# EAGLE design OBC (EAGLE 7.7.0)
OBC with integrated microcontroller
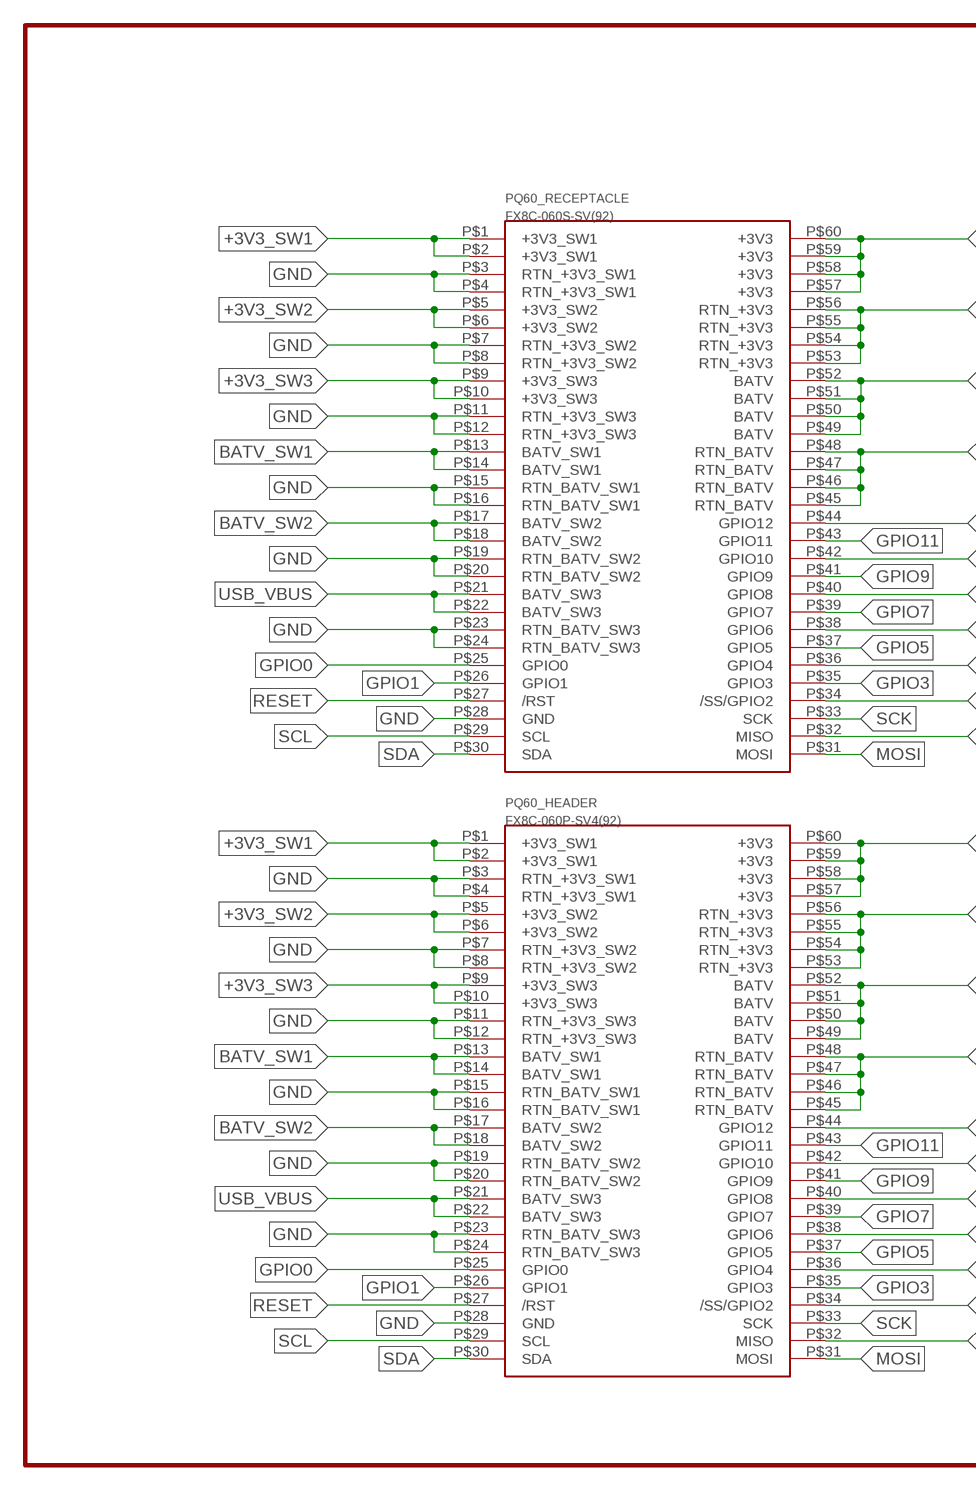
[diagram p0: schematic, sheet 1, part 1 of 2]
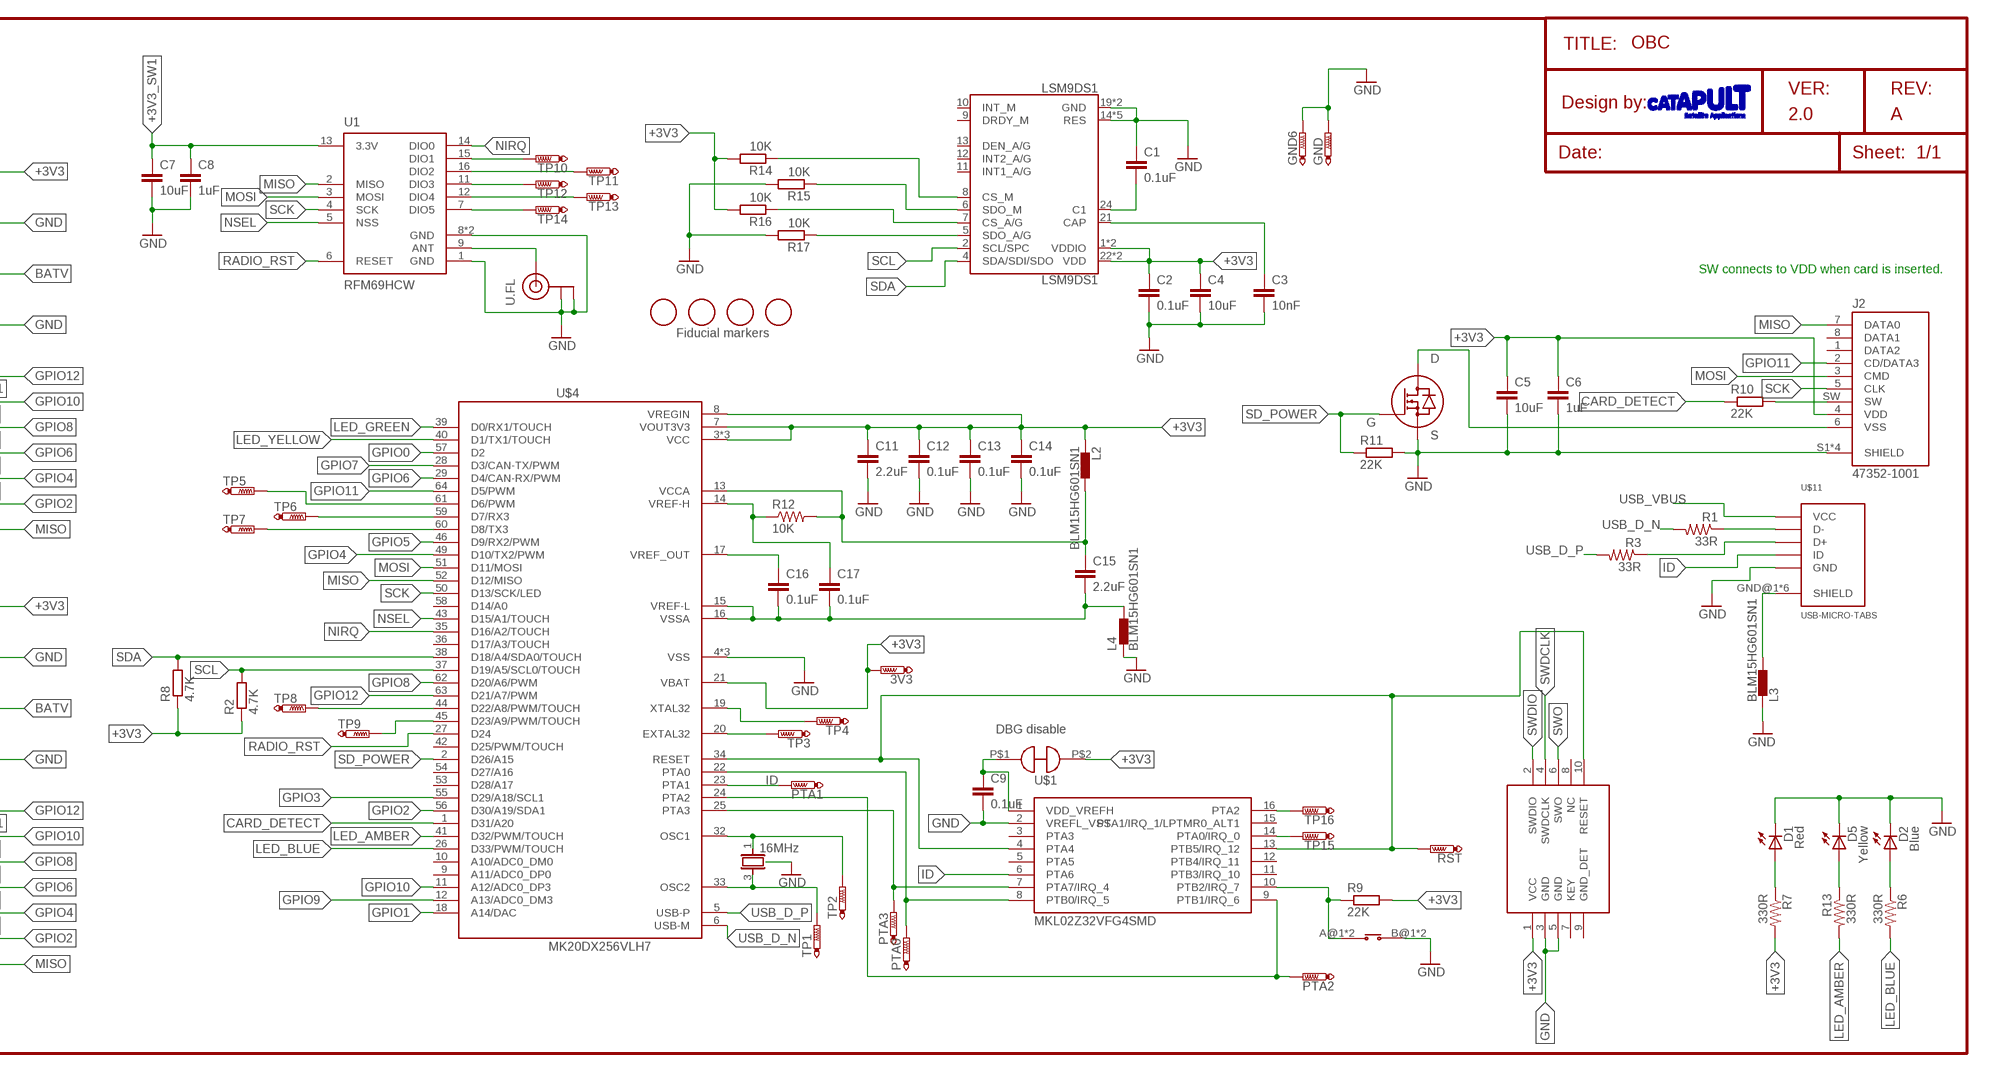
[diagram p1: schematic, sheet 1, part 2 of 2]

## Parts
3V3  PTR1TP06R  [TP06R]
C1  0.1uF  C-EUC0402  [C0402]
C2  0.1uF  C-EUC0402  [C0402]
C3  10nF  C-EUC0402  [C0402]
C4  10uF  C-EUC0805  [C0805]
C5  10uF  C-EUC0805  [C0805]
C6  1uF  C-EUC0603  [C0603]
C7  10uF  C-EUC0805  [C0805]
C8  1uF  C-EUC0603  [C0603]
C9  0.1uF  C-EUC0402  [C0402]
C11  2.2uF  C-EUC0603  [C0603]
C12  0.1uF  C-EUC0402  [C0402]
C13  0.1uF  C-EUC0402  [C0402]
C14  0.1uF  C-EUC0402  [C0402]
C15  2.2uF  C-EUC0603  [C0603]
C16  0.1uF  C-EUC0402  [C0402]
C17  0.1uF  C-EUC0402  [C0402]
D1  Red  LEDCHIPLED_0603  [CHIPLED_0603]
D2  Blue  LEDCHIPLED_0603  [CHIPLED_0603]
D5  Yellow  LEDCHIPLED_0603  [CHIPLED_0603]
ERASE  EVPAF7B70  [EVPAF7B70]
FD1  FIDUCIAL  [FIDUCIAL_1MM]
FD2  FIDUCIAL  [FIDUCIAL_1MM]
FD3  FIDUCIAL  [FIDUCIAL_1MM]
FD4  FIDUCIAL  [FIDUCIAL_1MM]
GND  PTR1TP06R  [TP06R]
GND6  PTR1TP06R  [TP06R]
J2  47352-1001  [MOLEX_47352-1001]
L2  BLM15HG601SN1  [0402]
L3  BLM15HG601SN1  [0402]
L4  BLM15HG601SN1  [0402]
LSM9DS1  LSM9DS1  [LGA24-8X4]
NDK_NX3225SA  16MHz  NDKCRYSTAL  [4SMD_DFN_LCC]
PQ60_HEADER  FX8C-060P-SV4(92)  [FX8C-060P-SV4(92)]
PQ60_RECEPTACLE  FX8C-060S-SV(92)  [FX8C-060S-SV(92)]
PTA0  PTR1TP06R  [TP06R]
PTA1  PTR1TP06R  [TP06R]
PTA2  PTR1TP06R  [TP06R]
PTA3  PTR1TP06R  [TP06R]
R1  33R  RESISTOR0603-RES  [0603-RES]
R2  4.7K  R-EU_R0402  [R0402]
R3  33R  RESISTOR0603-RES  [0603-RES]
R6  330R  RESISTOR0603-RES  [0603-RES]
R7  330R  RESISTOR0603-RES  [0603-RES]
R8  4.7K  R-EU_R0402  [R0402]
R9  22K  R-EU_R0402  [R0402]
R10  22K  R-EU_R0402  [R0402]
R11  22K  R-EU_R0402  [R0402]
R12  10K  RESISTOR0402-RES  [0402-RES]
R13  330R  RESISTOR0603-RES  [0603-RES]
R14  10K  R-EU_R0402  [R0402]
R15  10K  R-EU_R0402  [R0402]
R16  10K  R-EU_R0402  [R0402]
R17  10K  R-EU_R0402  [R0402]
RST  PTR1TP06R  [TP06R]
SJ3  SJNC  [SJNC]
TP1  PTR1TP06R  [TP06R]
TP2  PTR1TP06R  [TP06R]
TP3  PTR1TP06R  [TP06R]
TP4  PTR1TP06R  [TP06R]
TP5  PTR1TP06R  [TP06R]
TP6  PTR1TP06R  [TP06R]
TP7  PTR1TP06R  [TP06R]
TP8  PTR1TP06R  [TP06R]
TP9  PTR1TP06R  [TP06R]
TP10  PTR1TP06R  [TP06R]
TP11  PTR1TP06R  [TP06R]
TP12  PTR1TP06R  [TP06R]
TP13  PTR1TP06R  [TP06R]
TP14  PTR1TP06R  [TP06R]
TP15  PTR1TP06R  [TP06R]
TP16  PTR1TP06R  [TP06R]
U1  RFM69HCW  [RFM69HCW-XXXS2]
U$1  MKL02Z32VFG4SMD  [QFN16]
U$3  PMV40UN2  [SOT23-3]
U$4  MK20DX256VLH7  [QFP50P1200X1200X160-64N]
U$9  SWD_10_PIN  [SWD_10_PIN]
U$11  USB-MICRO-TABS  [USB-MICRO-TABS]
U.FL  U.FL  [U.FL]

## Nets
+3V3: 3V3.TP C2.1 C4.1 C5.1 C6.1 C11.1 C12.1 C13.1 C14.1 J2.4(VDD) L2.1 LSM9DS1.1(VDDIO) LSM9DS1.3(VDDIO) LSM9DS1.22(VDD) LSM9DS1.23(VDD) PQ60_HEADER.P$57(+3V3) PQ60_HEADER.P$58(+3V3) PQ60_HEADER.P$59(+3V3) PQ60_HEADER.P$60(+3V3) PQ60_RECEPTACLE.P$57(+3V3) PQ60_RECEPTACLE.P$58(+3V3) PQ60_RECEPTACLE.P$59(+3V3) PQ60_RECEPTACLE.P$60(+3V3) R2.1 R7.2 R8.1 R9.2 R14.2 R16.2 SJ3.P$2 U$4.3(VCC) U$4.7(VOUT3V3) U$4.8(VREGIN) U$4.21(VBAT) U$4.30(VCC) U$4.48(VCC) U$9.1(VCC)
+3V3_SW1: C7.1 C8.1 PQ60_HEADER.P$1(+3V3_SW1) PQ60_HEADER.P$2(+3V3_SW1) PQ60_RECEPTACLE.P$1(+3V3_SW1) PQ60_RECEPTACLE.P$2(+3V3_SW1) U1.13(3.3V)
+3V3_SW2: PQ60_HEADER.P$5(+3V3_SW2) PQ60_HEADER.P$6(+3V3_SW2) PQ60_RECEPTACLE.P$5(+3V3_SW2) PQ60_RECEPTACLE.P$6(+3V3_SW2)
+3V3_SW3: PQ60_HEADER.P$9(+3V3_SW3) PQ60_HEADER.P$10(+3V3_SW3) PQ60_RECEPTACLE.P$9(+3V3_SW3) PQ60_RECEPTACLE.P$10(+3V3_SW3)
BATV: PQ60_HEADER.P$49(BATV) PQ60_HEADER.P$50(BATV) PQ60_HEADER.P$51(BATV) PQ60_HEADER.P$52(BATV) PQ60_RECEPTACLE.P$49(BATV) PQ60_RECEPTACLE.P$50(BATV) PQ60_RECEPTACLE.P$51(BATV) PQ60_RECEPTACLE.P$52(BATV)
BATV_SW1: PQ60_HEADER.P$13(BATV_SW1) PQ60_HEADER.P$14(BATV_SW1) PQ60_RECEPTACLE.P$13(BATV_SW1) PQ60_RECEPTACLE.P$14(BATV_SW1)
BATV_SW2: PQ60_HEADER.P$17(BATV_SW2) PQ60_HEADER.P$18(BATV_SW2) PQ60_RECEPTACLE.P$17(BATV_SW2) PQ60_RECEPTACLE.P$18(BATV_SW2)
CARD_DETECT: R10.1 U$4.1(D31/A20)
GND: C1.1 C2.2 C3.2 C4.2 C5.2 C6.2 C7.2 C8.2 C9.2 C11.2 C12.2 C13.2 C14.2 D1.C D2.C D5.C ERASE.B@1 ERASE.B@2 GND6.TP GND.TP J2.S1(SHIELD) J2.S2(SHIELD) J2.S3(SHIELD) J2.S4(SHIELD) L3.1 L4.1 LSM9DS1.14(RES) LSM9DS1.15(RES) LSM9DS1.16(RES) LSM9DS1.17(RES) LSM9DS1.18(RES) LSM9DS1.19(GND) LSM9DS1.20(GND) NDK_NX3225SA.GND NDK_NX3225SA.GND@1(GND) NDK_NX3225SA.GND@2(GND) PQ60_HEADER.P$3(RTN_+3V3_SW1) PQ60_HEADER.P$4(RTN_+3V3_SW1) PQ60_HEADER.P$7(RTN_+3V3_SW2) PQ60_HEADER.P$8(RTN_+3V3_SW2) PQ60_HEADER.P$11(RTN_+3V3_SW3) PQ60_HEADER.P$12(RTN_+3V3_SW3) PQ60_HEADER.P$15(RTN_BATV_SW1) PQ60_HEADER.P$16(RTN_BATV_SW1) PQ60_HEADER.P$19(RTN_BATV_SW2) PQ60_HEADER.P$20(RTN_BATV_SW2) PQ60_HEADER.P$23(RTN_BATV_SW3) PQ60_HEADER.P$24(RTN_BATV_SW3) PQ60_HEADER.P$28(GND) PQ60_HEADER.P$45(RTN_BATV) PQ60_HEADER.P$46(RTN_BATV) PQ60_HEADER.P$47(RTN_BATV) PQ60_HEADER.P$48(RTN_BATV) PQ60_HEADER.P$53(RTN_+3V3) PQ60_HEADER.P$54(RTN_+3V3) PQ60_HEADER.P$55(RTN_+3V3) PQ60_HEADER.P$56(RTN_+3V3) PQ60_RECEPTACLE.P$3(RTN_+3V3_SW1) PQ60_RECEPTACLE.P$4(RTN_+3V3_SW1) PQ60_RECEPTACLE.P$7(RTN_+3V3_SW2) PQ60_RECEPTACLE.P$8(RTN_+3V3_SW2) PQ60_RECEPTACLE.P$11(RTN_+3V3_SW3) PQ60_RECEPTACLE.P$12(RTN_+3V3_SW3) PQ60_RECEPTACLE.P$15(RTN_BATV_SW1) PQ60_RECEPTACLE.P$16(RTN_BATV_SW1) PQ60_RECEPTACLE.P$19(RTN_BATV_SW2) PQ60_RECEPTACLE.P$20(RTN_BATV_SW2) PQ60_RECEPTACLE.P$23(RTN_BATV_SW3) PQ60_RECEPTACLE.P$24(RTN_BATV_SW3) PQ60_RECEPTACLE.P$28(GND) PQ60_RECEPTACLE.P$45(RTN_BATV) PQ60_RECEPTACLE.P$46(RTN_BATV) PQ60_RECEPTACLE.P$47(RTN_BATV) PQ60_RECEPTACLE.P$48(RTN_BATV) PQ60_RECEPTACLE.P$53(RTN_+3V3) PQ60_RECEPTACLE.P$54(RTN_+3V3) PQ60_RECEPTACLE.P$55(RTN_+3V3) PQ60_RECEPTACLE.P$56(RTN_+3V3) R11.2 R15.2 R17.2 U1.1(GND) U1.8(GND) U1.10(GND) U$1.2(VREFL_VSS) U$3.2(S) U$4.4(VSS) U$4.31(VSS) U$4.47(VSS) U$9.3(GND) U$9.5(GND) U$11.PIN$5(GND) U.FL.P$1(GND) U.FL.P$2(GND)
GPIO0: PQ60_HEADER.P$25(GPIO0) PQ60_RECEPTACLE.P$25(GPIO0) U$4.57(D2)
GPIO1: PQ60_HEADER.P$26(GPIO1) PQ60_RECEPTACLE.P$26(GPIO1) U$4.18(A14/DAC)
GPIO2: PQ60_HEADER.P$34(/SS/GPIO2) PQ60_RECEPTACLE.P$34(/SS/GPIO2) U$4.56(D30/A19/SDA1)
GPIO3: PQ60_HEADER.P$35(GPIO3) PQ60_RECEPTACLE.P$35(GPIO3) U$4.55(D29/A18/SCL1)
GPIO4: PQ60_HEADER.P$36(GPIO4) PQ60_RECEPTACLE.P$36(GPIO4) U$4.49(D10/TX2/PWM)
GPIO5: PQ60_HEADER.P$37(GPIO5) PQ60_RECEPTACLE.P$37(GPIO5) U$4.46(D9/RX2/PWM)
GPIO6: PQ60_HEADER.P$38(GPIO6) PQ60_RECEPTACLE.P$38(GPIO6) U$4.29(D4/CAN-RX/PWM)
GPIO7: PQ60_HEADER.P$39(GPIO7) PQ60_RECEPTACLE.P$39(GPIO7) U$4.28(D3/CAN-TX/PWM)
GPIO8: PQ60_HEADER.P$40(GPIO8) PQ60_RECEPTACLE.P$40(GPIO8) U$4.62(D20/A6/PWM)
GPIO9: PQ60_HEADER.P$41(GPIO9) PQ60_RECEPTACLE.P$41(GPIO9) U$4.12(A13/ADC0_DM3)
GPIO10: PQ60_HEADER.P$42(GPIO10) PQ60_RECEPTACLE.P$42(GPIO10) U$4.11(A12/ADC0_DP3)
GPIO11: J2.2(CD/DATA3) PQ60_HEADER.P$43(GPIO11) PQ60_RECEPTACLE.P$43(GPIO11) U$4.64(D5/PWM)
GPIO12: PQ60_HEADER.P$44(GPIO12) PQ60_RECEPTACLE.P$44(GPIO12) U$4.63(D21/A7/PWM)
ID: PTA1.TP U$1.6(PTA6) U$4.23(PTA1) U$11.P$4(ID)
LED_AMBER: R13.2 U$4.41(D32/PWM/TOUCH)
LED_BLUE: R6.2 U$4.26(D33/PWM/TOUCH)
LED_GREEN: U$4.39(D0/RX1/TOUCH)
LED_YELLOW: U$4.40(D1/TX1/TOUCH)
MISO: J2.7(DATA0) PQ60_HEADER.P$32(MISO) PQ60_RECEPTACLE.P$32(MISO) U1.2(MISO) U$4.52(D12/MISO)
MOSI: J2.3(CMD) PQ60_HEADER.P$31(MOSI) PQ60_RECEPTACLE.P$31(MOSI) U1.3(MOSI) U$4.51(D11/MOSI)
N$1: NDK_NX3225SA.1 TP2.TP U$4.32(OSC1)
N$2: C9.1 SJ3.P$1 U$1.1(VDD_VREFH)
N$3: ERASE.A@1 ERASE.A@2 R9.1 U$1.10(PTB2/IRQ_7)
N$4: TP4.TP U$4.19(XTAL32)
N$5: R3.1 U$11.P$3(D+)
N$6: R1.1 U$11.P$2(D-)
N$7: TP3.TP U$4.20(EXTAL32)
N$8: TP5.TP U$4.61(D6/PWM)
N$9: J2.SW R10.2
N$11: TP16.TP U$1.16(PTA2)
N$12: TP10.TP U1.15(DIO1)
N$13: U1.9(ANT) U.FL.P$3(SIGNAL)
N$14: TP11.TP U1.16(DIO2)
N$15: J2.6(VSS) U$3.3(D)
N$16: TP12.TP U1.11(DIO3)
N$17: D2.A R6.1
N$18: TP13.TP U1.12(DIO4)
N$19: TP14.TP U1.7(DIO5)
N$20: RST.TP U$1.4(PTA4) U$1.13(PTB5/IRQ_12) U$4.34(RESET) U$9.10(RESET)
N$21: TP15.TP U$1.14(PTA0/IRQ_0)
N$22: D1.A R7.1
N$23: NDK_NX3225SA.3 TP1.TP U$4.33(OSC2)
N$24: C15.1 L2.2 R12.2 U$4.13(VCCA)
N$25: C17.1 R12.1 U$4.14(VREF-H)
N$26: C15.2 C16.2 C17.2 L4.2 U$4.15(VREF-L) U$4.16(VSSA)
N$27: C16.1 U$4.17(VREF_OUT)
N$28: TP6.TP U$4.59(D7/RX3)
N$29: TP7.TP U$4.60(D8/TX3)
N$30: TP8.TP U$4.44(D22/A8/PWM/TOUCH)
N$31: TP9.TP U$4.45(D23/A9/PWM/TOUCH)
N$32: C1.2 LSM9DS1.24(C1)
N$33: C3.1 LSM9DS1.21(CAP)
N$34: LSM9DS1.7(CS_A/G) R16.1
N$35: LSM9DS1.8(CS_M) R14.1
N$37: D5.A R13.1
N$38: LSM9DS1.6(SDO_M) R15.1
N$39: LSM9DS1.5(SDO_A/G) R17.1
NIRQ: U1.14(DIO0) U$4.35(D16/A2/TOUCH)
NSEL: U1.5(NSS) U$4.43(D15/A1/TOUCH)
RADIO_RST: U1.6(RESET) U$4.27(D24)
RESET: PQ60_HEADER.P$27(/RST) PQ60_RECEPTACLE.P$27(/RST)
SCK: J2.5(CLK) PQ60_HEADER.P$33(SCK) PQ60_RECEPTACLE.P$33(SCK) U1.4(SCK) U$4.50(D13/SCK/LED)
SCL: LSM9DS1.2(SCL/SPC) PQ60_HEADER.P$29(SCL) PQ60_RECEPTACLE.P$29(SCL) R2.2 U$4.37(D19/A5/SCL0/TOUCH)
SD_POWER: R11.1 U$3.1(G) U$4.2(D26/A15)
SDA: LSM9DS1.4(SDA/SDI/SDO) PQ60_HEADER.P$30(SDA) PQ60_RECEPTACLE.P$30(SDA) R8.2 U$4.38(D18/A4/SDA0/TOUCH)
SHIELD: L3.2 U$11.GND@1(SHIELD) U$11.GND@2(SHIELD) U$11.GND@3(SHIELD) U$11.GND@4(SHIELD) U$11.GND@5(SHIELD) U$11.GND@6(SHIELD)
SWDCLK: PTA0.TP U$1.8(PTB0/IRQ_5) U$4.22(PTA0) U$9.4(SWDCLK)
SWDIO: PTA3.TP U$1.7(PTA7/IRQ_4) U$4.25(PTA3) U$9.2(SWDIO)
SWO: PTA2.TP U$1.9(PTB1/IRQ_6) U$4.24(PTA2) U$9.6(SWO)
USB_D_N [USB]: R1.2 U$4.6(USB-M)
USB_D_P [USB]: R3.2 U$4.5(USB-P)
USB_VBUS: PQ60_HEADER.P$21(BATV_SW3) PQ60_HEADER.P$22(BATV_SW3) PQ60_RECEPTACLE.P$21(BATV_SW3) PQ60_RECEPTACLE.P$22(BATV_SW3) U$11.P$1(VCC)
Unconnected: J2.1(DATA2) J2.8(DATA1) LSM9DS1.9(DRDY_M) LSM9DS1.10(INT_M) LSM9DS1.11(INT1_A/G) LSM9DS1.12(INT2_A/G) LSM9DS1.13(DEN_A/G) U$1.3(PTA3) U$1.5(PTA5) U$1.11(PTB3/IRQ_10) U$1.12(PTB4/IRQ_11) U$1.15(PTA1/IRQ_1/LPTMR0_ALT1) U$4.9(A11/ADC0_DP0) U$4.10(A10/ADC0_DM0) U$4.36(D17/A3/TOUCH) U$4.42(D25/PWM/TOUCH) U$4.53(D28/A17) U$4.54(D27/A16) U$4.58(D14/A0) U$9.7(KEY) U$9.8(NC) U$9.9(GND_DET)

## Notes on the sheet
- TITLE:
- VER: | REV:
- Design by:
- 2.0 | A
- Date: | Sheet:
- SW connects to VDD when card is inserted.
- Fiducial markers
- DBG disable

## Library data of the parts
3V3 GND GND6 PTA0 PTA1-PTA3 RST TP1-TP16 = testpad:PTR1: TEST PIN
C1-C9 C11-C17 = resistor:C-EU: CAPACITOR, European symbol
D1 D2 D5 = adafruit:LED: LED OSRAM: - CHIPLED LG R971, LG N971, LY N971, LG Q971, LY Q971, LO R971, LY R971 LH N974, LH R974 LS Q976, LO Q976, LY Q976 LO Q996 - Hyper CHIPLED LW Q18S LB Q993, LB Q99A, LB R99A - SideLED LS A670, LO A670, LY A670, LG A670, LP A670 LB A673, LV A673, LT A673, LW A673 LH A674 LY A675 LS A676, LA A676, LO A676, LY A676, LW A676 LS A679, LY A679, LG A679 - Hyper Micro SIDELED® LS Y876, LA Y876, LO Y876, LY Y876 LT Y87S - SmartLED LW L88C, LW L88S LB L89C, LB L89S, LG L890 LS L89K, LO L89K, LY L89K LS L896, LA L896, LO L896, LY L896 - TOPLED LS T670, LO T670, LY T670, LG T670, LP T670 LSG T670, LSP T670, LSY T670, LOP T670, LYG T670 LG T671, LOG T671, LSG T671 LB T673, LV T673, LT T673, LW T673 LH T674 LS T676, LA T676, LO T676, LY T676, LB T676, LH T676, LSB T676, LW T676 LB T67C, LV T67C, LT T67C, LS T67K, LO T67K, LY T67K, LW E67C LS E67B, LA E67B, LO E67B, LY E67B, LB E67C, LV E67C, LT E67C LW T67C LS T679, LY T679, LG T679 LS T770, LO T770, LY T770, LG T770, LP T770 LB T773, LV T773, LT T773, LW T773 LH T774 LS E675, LA E675, LY E675, LS T675 LS T776, LA T776, LO T776, LY T776, LB T776 LHGB T686 LT T68C, LB T68C - Hyper Mini TOPLED® LB M676 - Mini TOPLED Santana® LG M470 LS M47K, LO M47K, LY M47K Source: http://www.osram.convergy.de/
ERASE = ubo_PQ60:EVPAF7B70
FD1-FD4 = ubo_PQ60:FIDUCIAL: For use by pick and place machines to calibrate the vision/machine, 1mm By microbuilder.eu
J2 = ubo_PQ60:47352-1001: 1.10mm Pitch microSD Card Connector, Push-Push Type, with VSS (Supply Voltage Ground) Detect Switch, Lead-Free; AVAILABILITY: Unavailable; DESCRIPTION: 1.10mm Pitch microSD Card Connector, Push-Push Type, with VSS _Supply Voltage Ground_ Detect Switch, Lead-Free; MF: Molex; MP: 473521001; PACKAGE: None; PRICE: None
L2-L4 = inductors:BLM15H: EMIFIL (R) Chip Ferrite Bead for GHz Noise Source: http://www.murata.com/ Ferrite Bead BLM15H.pdf
LSM9DS1 = ubo_PQ60:LSM9DS1: LSM9DS1 3D accelerometer, gyroscope & magnetometer The LSM9DS1 is a system-in-package featuring a 3D digital linear acceleration sensor, a 3D digital angular rate sensor, and a 3D digital magnetic sensor. The LSM9DS1 has a linear acceleration full scale of ±2g/±4g/±8/±16 g, a magnetic field full scale of ±4/±8/±12/±16 gauss and an angular rate of ±245/±500/±2000 dps. The LSM9DS1 includes an I2 C serial bus interface supporting standard and fast mode (100 kHz and 400 kHz) and an SPI serial standard interface. Magnetic, accelerometer and gyroscope sensing can be enabled or set in power-down mode separately for smart power management. The LSM9DS1 is available in a plastic land grid array package (LGA) and it is guaranteed to operate over an extended temperature range from -40 °C to +85 °C.; PROD_ID: IC-12536
NDK_NX3225SA = OBC:NDKCRYSTAL
PQ60_HEADER = OBC:FX8C-060P-SV4(92)
PQ60_RECEPTACLE = Template:FX8C-060S-SV(92)
R1 R3 R6 R7 R12 R13 = SparkFun-Passives:RESISTOR: Resistor Basic schematic elements and footprints for 0603, 1206, and PTH resistors.
R2 R8-R11 R14-R17 = resistor:R-EU_: RESISTOR, European symbol
SJ3 = ubo_PQ60:SJNC
U1 = SparkFun-RF:RFM69H
U$1 = OBC:MKL02Z32VFG4: Kinetis KL02 32 KB Flash 48 MHz Cortex-M0+ Based Microcontroller
U$3 = ubo_PQ60:PMV40UN2
U$4 = Teensy_3_Series_Chip_v1.2:MK20DX256VLH7: This is a footprint for the MK20dx256VHL7, the chip at the heart of the Teensy 3.1. Notable upgrades over the Teensy 3.0 include more Flash Memory, RAM, a DAC output, additional ADC pins, etc. Remember, if you want to use USB, VOut3v3 has to be attached to the 3.3V bus.
U$9 = OBC:SWD_10_PIN
U$11 = ubo_PQ60:USB-MICRO-TABS
U.FL = SparkFun-Connectors:U.FL: SMD antenna connector- WRL-09144; PROD_ID: CONN-09193

## Net classes
1 USB: width 1.295 mm, drill 0.4 mm, clearance 0.15 mm

## Board
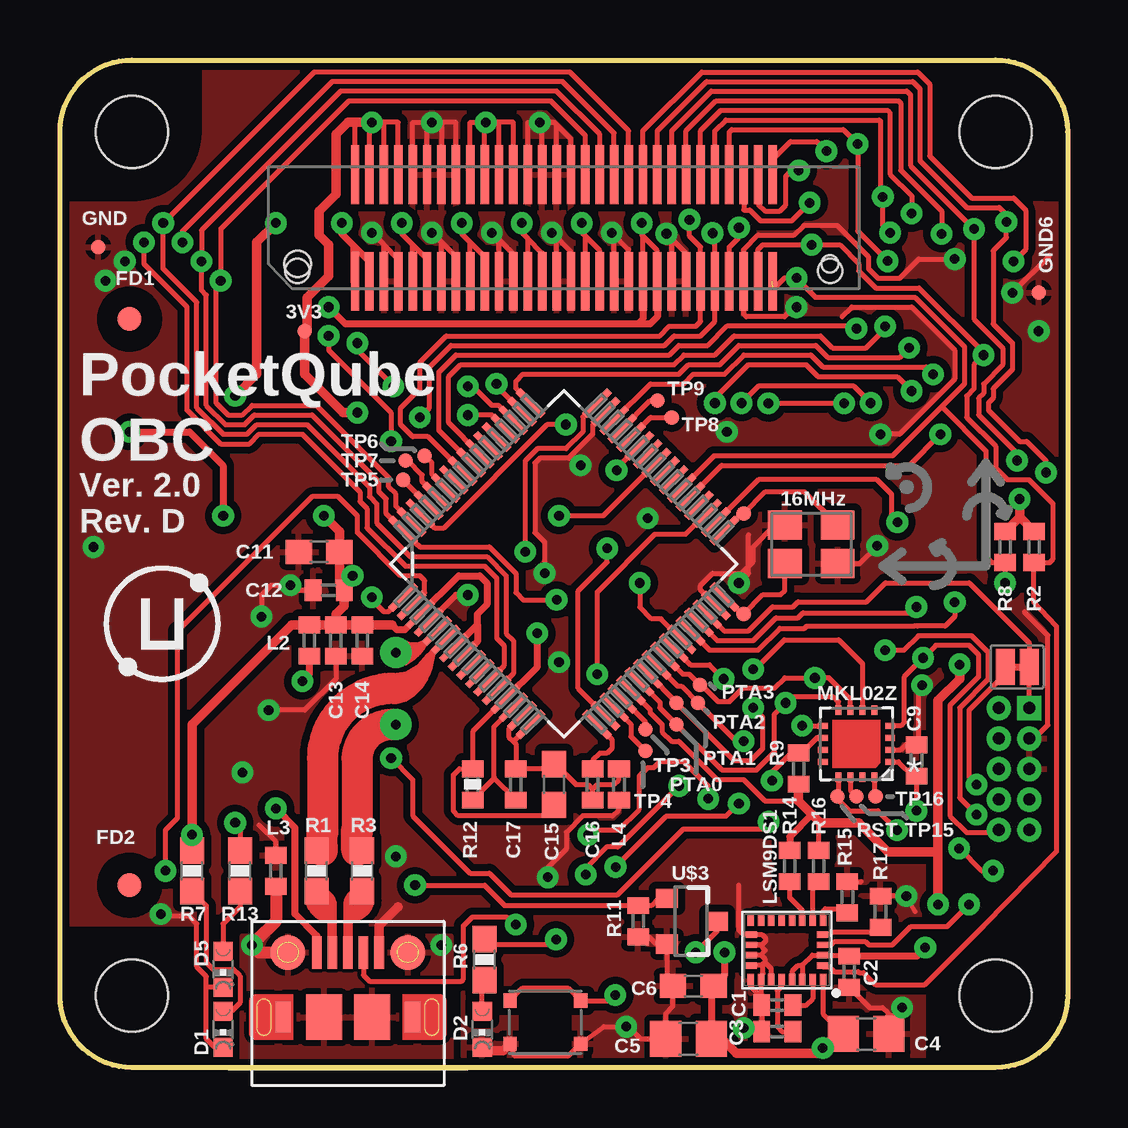
[diagram p2: board, top side]
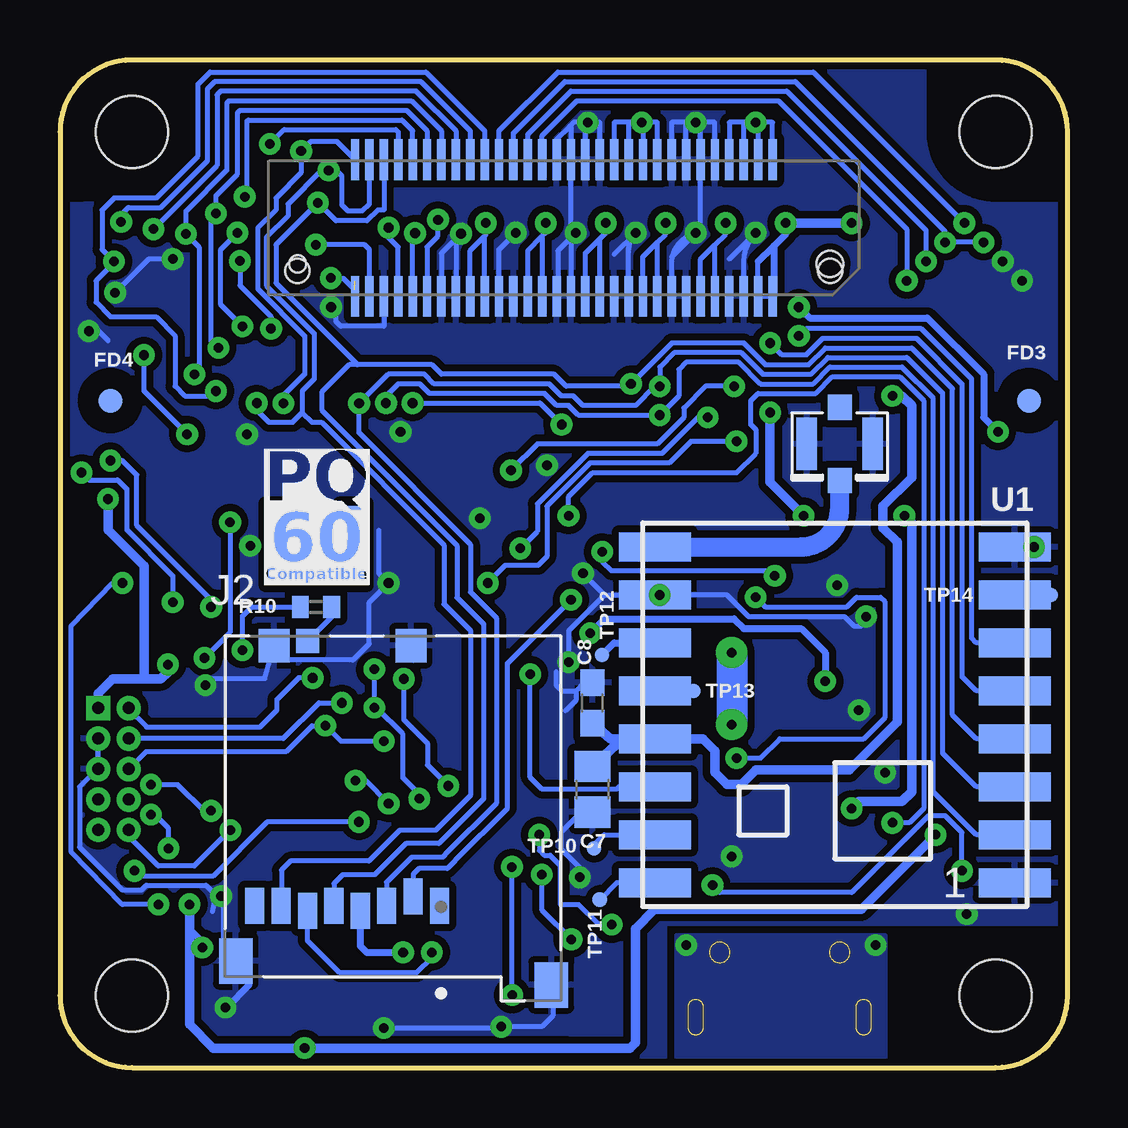
[diagram p3: board, bottom side, seen from below]

Size 42 x 42 mm. Coordinates in mm from the lower left corner, seen from the top.
Outline: 0,3 0,39 arc-90 3,42 39,42 arc-90 42,39 42,3 arc-90 39,0 3,0 arc-90 0,3
Copper layers (1*16): Top 0.035mm / dielectric 1.5mm / Bottom 0.035mm
Design rules "pcbtrain *": minimum track width 0.2mm, minimum drill 0.4mm, track to track 0.15mm, track to pad 0.15mm, pad to pad 0.15mm, via to via 0.2mm, smd to smd 0mil, copper to edge 10mil, drill to drill 0.2mm, minimum pad ring 10mil, minimum via ring 10mil, stop-mask expansion 0.125mm, vias tented up to drill 0.5mm, thermal gap 10mil
Holes 3 mm at 3,3 39,3 39,39 3,39
tKeepout: area 0,0 to 6,6; area 36,0 to 42,6; area 36,36 to 42,42; area 0,36 to 6,42
bKeepout: area 0,36 to 6,42; area 36,36 to 42,42
Milling: 8 lines

### Footprints (pad centres in the part's own frame; a part is rotated, then mirrored left to right if it is on the bottom)
TP06R = smd 0.6 x 0.6: TP 0,0
C0402 = smd 0.7 x 0.9: 1 -0.65,0; 2 0.65,0
C0805 = smd 1.3 x 1.5: 1 -0.95,0; 2 0.95,0
C0603 = smd 1.1 x 1: 1 -0.85,0; 2 0.85,0
CHIPLED_0603 = smd 0.8 x 0.8: A 0,-0.75; C 0,0.75
EVPAF7B70 = smd 0.55 x 0.6: A@1 -1.475,0.9; A@2 1.475,0.9; B@1 -1.475,-0.9; B@2 1.475,-0.9
FIDUCIAL_1MM = smd 1 x 1: 1 0,0
MOLEX_47352-1001 = smd 0.8 x 1.5: 1 1.94,-3.66; 2 0.84,-3.26; 3 -0.26,-3.66; 4 -1.36,-3.86; 5 -2.46,-3.66; 6 -3.56,-3.86; 7 -4.66,-3.66; 8 -5.76,-3.66 | smd 1.3 x 1.4: S1 -4.95,7.2; S2 0.75,7.2 | smd 1.4 x 1.9: S3 -6.55,-5.95; S4 6.6,-6.95 | smd 0.95 x 1: SW -3.56,7.4
0402 = smd 0.7 x 0.9: 1 -0.65,0; 2 0.65,0
LGA24-8X4 = smd 0.27 x 0.45: 1 -1.505,1.225; 6 -1.505,-1.225; 7 -1.075,-1.225; 8 -0.645,-1.225; 9 -0.215,-1.225; 10 0.215,-1.225; 11 0.645,-1.225; 12 1.075,-1.225; 13 1.505,-1.225; 18 1.505,1.225; 19 1.075,1.225; 20 0.645,1.225; 21 0.215,1.225; 22 -0.215,1.225; 23 -0.645,1.225; 24 -1.075,1.225 | smd 0.45 x 0.27: 2 -1.475,0.645; 3 -1.475,0.215; 4 -1.475,-0.215; 5 -1.475,-0.645; 14 1.475,-0.645; 15 1.475,-0.215; 16 1.475,0.215; 17 1.475,0.645
4SMD_DFN_LCC = smd 1.4 x 1.2: 1 -1.1,-0.8; 3 1.1,0.8; GND@1 1.1,-0.8; GND@2 -1.1,0.8 | smd 4 x 3.2 bottom: GND 0,0
FX8C-060P-SV4(92) = smd 0.35 x 2.45: P$1 -8.7,-2.225; P$2 -8.1,-2.225; P$3 -7.5,-2.225; P$4 -6.9,-2.225; P$5 -6.3,-2.225; P$6 -5.7,-2.225; P$7 -5.1,-2.225; P$8 -4.5,-2.225; P$9 -3.9,-2.225; P$10 -3.3,-2.225; P$11 -2.7,-2.225; P$12 -2.1,-2.225; P$13 -1.5,-2.225; P$14 -0.9,-2.225; P$15 -0.3,-2.225; P$16 0.3,-2.225; P$17 0.9,-2.225; P$18 1.5,-2.225; P$19 2.1,-2.225; P$20 2.7,-2.225; P$21 3.3,-2.225; P$22 3.9,-2.225; P$23 4.5,-2.225; P$24 5.1,-2.225; P$25 5.7,-2.225; P$26 6.3,-2.225; P$27 6.9,-2.225; P$28 7.5,-2.225; P$29 8.1,-2.225; P$30 8.7,-2.225; P$31 8.7,2.225; P$32 8.1,2.225; P$33 7.5,2.225; P$34 6.9,2.225; P$35 6.3,2.225; P$36 5.7,2.225; P$37 5.1,2.225; P$38 4.5,2.225; P$39 3.9,2.225; P$40 3.3,2.225; P$41 2.7,2.225; P$42 2.1,2.225; P$43 1.5,2.225; P$44 0.9,2.225; P$45 0.3,2.225; P$46 -0.3,2.225; P$47 -0.9,2.225; P$48 -1.5,2.225; P$49 -2.1,2.225; P$50 -2.7,2.225; P$51 -3.3,2.225; P$52 -3.9,2.225; P$53 -4.5,2.225; P$54 -5.1,2.225; P$55 -5.7,2.225; P$56 -6.3,2.225; P$57 -6.9,2.225; P$58 -7.5,2.225; P$59 -8.1,2.225; P$60 -8.7,2.225 | hole 1.1: -11.1,-1.499 | hole 0.7: 11.1,-1.499
FX8C-060S-SV(92) = smd 0.35 x 1.7: P$1 -8.7,2.85; P$2 -8.1,2.85; P$3 -7.5,2.85; P$4 -6.9,2.85; P$5 -6.3,2.85; P$6 -5.7,2.85; P$7 -5.1,2.85; P$8 -4.5,2.85; P$9 -3.9,2.85; P$10 -3.3,2.85; P$11 -2.7,2.85; P$12 -2.1,2.85; P$13 -1.5,2.85; P$14 -0.9,2.85; P$15 -0.3,2.85; P$16 0.3,2.85; P$17 0.9,2.85; P$18 1.5,2.85; P$19 2.1,2.85; P$20 2.7,2.85; P$21 3.3,2.85; P$22 3.9,2.85; P$23 4.5,2.85; P$24 5.1,2.85; P$25 5.7,2.85; P$26 6.3,2.85; P$27 6.9,2.85; P$28 7.5,2.85; P$29 8.1,2.85; P$30 8.7,2.85; P$31 8.7,-2.85; P$32 8.1,-2.85; P$33 7.5,-2.85; P$34 6.9,-2.85; P$35 6.3,-2.85; P$36 5.7,-2.85; P$37 5.1,-2.85; P$38 4.5,-2.85; P$39 3.9,-2.85; P$40 3.3,-2.85; P$41 2.7,-2.85; P$42 2.1,-2.85; P$43 1.5,-2.85; P$44 0.9,-2.85; P$45 0.3,-2.85; P$46 -0.3,-2.85; P$47 -0.9,-2.85; P$48 -1.5,-2.85; P$49 -2.1,-2.85; P$50 -2.7,-2.85; P$51 -3.3,-2.85; P$52 -3.9,-2.85; P$53 -4.5,-2.85; P$54 -5.1,-2.85; P$55 -5.7,-2.85; P$56 -6.3,-2.85; P$57 -6.9,-2.85; P$58 -7.5,-2.85; P$59 -8.1,-2.85; P$60 -8.7,-2.85 | hole 1: -11.1,1.8; 11.1,1.8
0603-RES = smd 1.1 x 1: 1 -0.85,0; 2 0.85,0
R0402 = smd 0.7 x 0.9: 1 -0.65,0; 2 0.65,0
0402-RES = smd 0.7 x 0.9: 1 -0.65,0; 2 0.65,0
SJNC = smd 0.8 x 1.5: P$1 -0.5,0; P$2 0.5,0
RFM69HCW-XXXS2 = smd 3 x 1.2: 1 -7.5,7; 2 -7.5,5; 3 -7.5,3; 4 -7.5,1; 5 -7.5,-1; 6 -7.5,-3; 7 -7.5,-5; 8 -7.5,-7; 9 7.5,-7; 10 7.5,-5; 11 7.5,-3; 12 7.5,-1; 13 7.5,1; 14 7.5,3; 15 7.5,5; 16 7.5,7
QFN16 = smd 0.4 x 0.25: 1 -1.4,0.75; 2 -1.4,0.25; 3 -1.4,-0.25; 4 -1.4,-0.75; 9 1.4,-0.75; 10 1.4,-0.25; 11 1.4,0.25; 12 1.4,0.75 | smd 0.25 x 0.4: 5 -0.75,-1.4; 6 -0.25,-1.4; 7 0.25,-1.4; 8 0.75,-1.4; 13 0.75,1.4; 14 0.25,1.4; 15 -0.25,1.4; 16 -0.75,1.4
SOT23-3 = smd 0.8 x 0.9: 1 -0.95,-1; 2 0.95,-1; 3 0,1.1
QFP50P1200X1200X160-64N = smd 1.473 x 0.279: 1 -5.715,3.759; 2 -5.715,3.251; 3 -5.715,2.743; 4 -5.715,2.261; 5 -5.715,1.753; 6 -5.715,1.245; 7 -5.715,0.762; 8 -5.715,0.254; 9 -5.715,-0.254; 10 -5.715,-0.762; 11 -5.715,-1.245; 12 -5.715,-1.753; 13 -5.715,-2.261; 14 -5.715,-2.743; 15 -5.715,-3.251; 16 -5.715,-3.759; 33 5.715,-3.759; 34 5.715,-3.251; 35 5.715,-2.743; 36 5.715,-2.261; 37 5.715,-1.753; 38 5.715,-1.245; 39 5.715,-0.762; 40 5.715,-0.254; 41 5.715,0.254; 42 5.715,0.762; 43 5.715,1.245; 44 5.715,1.753; 45 5.715,2.261; 46 5.715,2.743; 47 5.715,3.251; 48 5.715,3.759 | smd 0.279 x 1.473: 17 -3.759,-5.715; 18 -3.251,-5.715; 19 -2.743,-5.715; 20 -2.261,-5.715; 21 -1.753,-5.715; 22 -1.245,-5.715; 23 -0.762,-5.715; 24 -0.254,-5.715; 25 0.254,-5.715; 26 0.762,-5.715; 27 1.245,-5.715; 28 1.753,-5.715; 29 2.261,-5.715; 30 2.743,-5.715; 31 3.251,-5.715; 32 3.759,-5.715; 49 3.759,5.715; 50 3.251,5.715; 51 2.743,5.715; 52 2.261,5.715; 53 1.753,5.715; 54 1.245,5.715; 55 0.762,5.715; 56 0.254,5.715; 57 -0.254,5.715; 58 -0.762,5.715; 59 -1.245,5.715; 60 -1.753,5.715; 61 -2.261,5.715; 62 -2.743,5.715; 63 -3.251,5.715; 64 -3.759,5.715
SWD_10_PIN = drill 0.5 square: 1 0,5.08 | drill 0.5: 2 1.27,5.08; 3 0,3.81; 4 1.27,3.81; 5 0,2.54; 6 1.27,2.54; 7 0,1.27; 8 1.27,1.27; 9 0,0; 10 1.27,0
USB-MICRO-TABS = smd 0.635 x 1.27: GND@1 -2.7,0; GND@2 2.7,0 | smd 1.5 x 1.9: GND@3 -1,0; GND@4 1,0 | smd 1.45 x 1.45: GND@5 -2.5,2.7; GND@6 2.5,2.7 | smd 0.4 x 1.35: P$1 -1.3,2.7; P$2 -0.65,2.7; P$3 0,2.7; P$4 0.65,2.7; PIN$5 1.3,2.7
U.FL = smd 2.2 x 0.85: P$1 0,1.375; P$2 0,-1.375 | smd 1.05 x 1: P$3 1.525,0; P$4 -1.525,0

### Placement (x,y rotation side)
3V3  10.2,30.7 0 top
C1  29.9,2.6 0 top
C2  32.9,4 270 top
C3  29.9,1.5 180 top
C4  33.6,1.4 0 top
C5  26.2,1.2 180 top
C6  26.4,3.4 180 top
C7  19.8,11.6 270 bottom
C8  19.8,15.2 90 bottom
C9  35.7,12.8 90 top
C11  10.8,21.5 180 top
C12  11.2,19.9 180 top
C13  11.5,17.8 270 top
C14  12.6,17.8 270 top
C15  20.6,11.8 90 top
C16  22.2,11.8 270 top
C17  19,11.8 90 top
D1  6.8,1.6 180 top
D2  17.6,1.6 180 top
D5  6.8,4.1 180 top
ERASE  20.23,1.89 0 top
FD1  2.9,31.2 0 top
FD2  2.9,7.6 0 top
FD3  1.6,27.8 0 bottom
FD4  39.9,27.8 0 bottom
GND  1.6,34.2 0 top
GND6  40.8,32.3 0 top
J2  28.12,10.39 0 bottom
L2  10.4,17.8 270 top
L3  9,8.2 270 top
L4  23.3,11.8 90 top
LSM9DS1  30.3,4.9 180 top
NDK_NX3225SA  31.32,21.81 0 top
PQ60_HEADER  21,35 0 top
PQ60_RECEPTACLE  21,35 180 bottom
PTA0  25.7,14.3 0 top
PTA1  25.7,15.2 0 top
PTA2  26.6,15.2 0 top
PTA3  26.67,15.95 0 top
R1  10.7,8.2 90 top
R2  40.6,21.7 270 top
R3  12.6,8.2 90 top
R6  17.7,4.5 90 top
R7  5.5,8.2 90 top
R8  39.4,21.7 270 top
R9  30.79,12.46 270 top
R10  31.33,19.2 0 bottom
R11  24.1,6.1 270 top
R12  17.2,11.8 90 top
R13  7.5,8.2 90 top
R14  30.42,8.4 90 top
R15  32.82,7.1 90 top
R16  31.63,8.4 90 top
R17  34.2,6.5 90 top
RST  32.4,11.3 0 top
SJ3  39.9,16.7 0 top
TP1  28.5,23.1 0 top
TP2  28.5,18.9 0 top
TP3  24.4,14.1 0 top
TP4  24.4,13.2 0 top
TP5  14.3,24.5 0 top
TP6  15.2,25.5 0 top
TP7  14.4,25.3 0 top
TP8  25.5,27.1 0 top
TP9  24.9,27.8 0 top
TP10  19.73,9.14 0 bottom
TP11  19.5,7 0 bottom
TP12  19.4,17.2 0 bottom
TP13  15.6,15.7 0 bottom
TP14  0.7,19.7 0 bottom
TP15  33.2,11.3 0 top
TP16  34,11.3 0 top
U1  9.7,14.7 180 bottom
U$1  33.2,13.5 180 top
U$2  [PQ60_CMP]  33.5,20.1 0 bottom
U$3  26.3,6.1 270 top
U$4  21,21 45 top
U$9  40.4,9.9 0 bottom
U$10  [UBO_LOGO]  1.8,16 0 top
U$11  12,2.1 0 top
U$13  [SA_LOGO_SMALL]  0.7,12.8 0 top
U.FL  9.5,26 270 bottom

### Tracks (layer width: path | path; a pad name or v marks a point on that pad's centre or on a via)
+3V3  (via drill 0.4)
  Top 0.2: PQ60_HEADER.P$59 12.9,39.4 v13,39.4 | PQ60_HEADER.P$60 12.3,39.4 v13,39.4 | PQ60_HEADER.P$58 13.5,39.4 | 13.5,39.4 v13,39.4 | PQ60_HEADER.P$57 14.1,39.4 13.5,39.4 | U$9.1 SJ3.P$2 40.4,17.7 37.9,20.2 34.41,20.2 33.62,19.41 30.77,19.41 30.56,19.2 29.7,19.2 28.7,18.2 27.68,18.2 U$4.30 | 32.2,1.9 C4.1 31.8,2.25 LSM9DS1.1 | U$4.21 24.6,14.92 24.6,14.8 25.1,14.3 25.1,14 25.5,13.6 25.8,13.6 27.4,12 28.5,12 29.39,11.11 30.79,11.11 | U$4.48 21.8,27.12 21.8,26.5 21.1,25.8 19.9,25.8 19.4,25.3 v19.4,21.5 | 30.65,12 R9.2 | 27.15,3.3 C6.1 | 30.95,4.28 LSM9DS1.23 | 30.95,4.28 31.36,4.68 LSM9DS1.3 32.87,4.68 C2.1 | 30.95,4.28 30.9,4.23 30.74,4.23 30.52,4 LSM9DS1.22 | R16.2 31.63,10.26 31.64,10.27
  Top 0.3: 27.15,3.3 C5.1 | 13.85,18.45 14.05,18.25 14.37,18.25 U$4.3 16.62,20.5 17.5,20.5 17.8,20.2 17.8,19.3 17.4,18.9 17.4,18.48 | 17.4,18.48 17.4,17.76 U$4.8 | U$4.7 17.4,18.48 | 31.35,10.55 30.42,9.62 R14.2 | v27.7,4.8 27.7,3.85 C6.1 | C2.1 35.72,4.65 v36.07,5
  Top 0.4: v13,39.4 12,39.4 11.5,38.9 11.5,36.4 10.8,35.7 10.8,34.7 11.2,34.3 11.2,33 10.3,32.1 10.3,30.8 3V3.TP 10.2,28.9 11.8,27.3 v12.4,27.3 | C13.1 C14.1 13.85,18.45 | C13.1 11.5,18.9 11.85,19.25 C12.1 | C13.1 L2.1 9.65,18.45 5.5,14.3 v5.5,9.7 R7.2 | C5.1 27.6,1.2 28.2,0.6 31.6,0.6 v31.8,0.81 32.4,1.4 C4.1 | R2.1 40,22.95 | R8.1 40,22.95 | 40,22.95 v40,23.7 | 36.6,9.1 36.6,15.3 37.5,16.2 v37.5,16.8 | 36.6,9.1 v36.6,6.8 | 36.6,9.1 36.5,9 34.5,9 33.3,10.2 31.7,10.2 31.64,10.27 31.35,10.55 30.79,11.11 R9.2 | v11,23 11.65,22.35 C11.1 11.65,20.1 C12.1 | v12.2,20.5 11.85,20.15 C12.1
  Bottom 0.2: PQ60_RECEPTACLE.P$60 12.3,39.4 v13,39.4 | 13.5,39.4 14.1,39.4 PQ60_RECEPTACLE.P$57 | v13,39.4 arc90 12.9,39.3 PQ60_RECEPTACLE.P$59 | PQ60_RECEPTACLE.P$58 13.5,39.4 | v13,39.4 13.5,39.4 | v19.4,21.5 19.4,21.1 19,20.7 12.4,20.7 v12.2,20.5 | J2.4 29.5,6.51
  Bottom 0.3: 29.5,6.51 29.48,6.49 29.48,5.07 29.21,4.8 v27.7,4.8 | v36.07,5 36.07,5.24 36.6,5.77
  Bottom 0.4: v5.5,9.7 8.6,6.6 17.21,6.6 18.02,5.79 18.02,1.03 18.25,0.8 20.8,0.8 v31.8,0.81 35.61,0.81 36.6,1.8 36.6,5.77 v36.6,6.8 | v40,23.7 40,22.4 38.5,20.9 38.5,16.2 | 38.5,16.2 39.8,16.2 40.4,15.6 U$9.1 | v12.4,27.3 12.4,24.4 v11,23 | 38.5,16.2 37.8,16.2 37.5,16.5 v37.5,16.8
+3V3_SW1  (via drill 0.4)
  Top 0.2: 12.9,32.75 PQ60_HEADER.P$2 12.9,33.6 | 12.25,32.75 12.28,32.77 PQ60_HEADER.P$1
  Top 0.3: 12.25,32.75 12.25,34.25 | 12.25,34.25 11.75,34.75 v11.75,35.2 | 12.9,33.6 12.25,34.25
  Top 0.4: v9,35.2 8.2,34.4 8.2,28.9 v7.3,28
  Bottom 0.2: PQ60_RECEPTACLE.P$1 12.25,32.2 12.25,32.25 arc90 12.35,32.15 PQ60_RECEPTACLE.P$2 12.9,33.6
  Bottom 0.3: v11.75,35.2 11.75,34.75 12.25,34.25 | 12.25,34.25 12.25,32.25 | 12.9,33.6 12.25,34.25
  Bottom 0.4: U1.13 18.55,13.7 C7.1 | U1.13 19.05,13.7 C8.1 | U1.13 15.2,13.7 14.7,13.2 14.7,12.3 14.2,11.8 13.6,11.8 13,12.4 9.1,12.4 7.1,14.4 7.1,21.9 7.7,22.5 7.7,23.4 6.5,24.6 6.5,27.6 6.9,28 v7.3,28 | v9,35.2 v11.75,35.2
+3V3_SW2  (via drill 0.4)
  Top 0.2: 14.7,34.3 15.3,33.7 PQ60_HEADER.P$6 | 14.7,34.3 14.25,34.75 v14.25,35.2 | PQ60_HEADER.P$5 14.7,34.3
  Bottom 0.2: 14.7,34.3 14.25,34.75 v14.25,35.2 | PQ60_RECEPTACLE.P$5 14.7,34.3 | PQ60_RECEPTACLE.P$6 15.3,33.7 14.7,34.3
+3V3_SW3  (via drill 0.4)
  Top 0.2: v16.75,35.2 16.75,34.75 17.1,34.4 | PQ60_HEADER.P$9 17.1,34.4 | PQ60_HEADER.P$10 17.7,33.8 17.1,34.4
  Bottom 0.2: 17.1,34.4 17.7,33.8 PQ60_RECEPTACLE.P$10 | 17.1,34.4 16.75,34.75 v16.75,35.2 | PQ60_RECEPTACLE.P$9 17.1,34.4
BATV  (via drill 0.4)
  Top 0.2: PQ60_HEADER.P$51 17.7,39.4 v17.75,39.4 | PQ60_HEADER.P$50 18.3,39.4 v17.75,39.4 | PQ60_HEADER.P$49 18.9,39.4 v17.75,39.4 | PQ60_HEADER.P$52 17.1,39.4 v17.75,39.4
  Bottom 0.2: PQ60_RECEPTACLE.P$52 17.1,39.4 v17.75,39.4 | v17.75,39.4 18.9,39.4 PQ60_RECEPTACLE.P$49 | v17.75,39.4 arc90 17.7,39.35 PQ60_RECEPTACLE.P$51 | 18.25,37.9 arc90 PQ60_RECEPTACLE.P$50 18.3,39.4 v17.75,39.4
BATV_SW1  (via drill 0.4)
  Top 0.2: 19.5,34.55 19.25,34.8 v19.25,35.2 | PQ60_HEADER.P$14 20.1,33.95 19.5,34.55 | PQ60_HEADER.P$13 19.5,34.55
  Bottom 0.2: 19.5,34.55 20.1,33.95 PQ60_RECEPTACLE.P$14 | 19.5,34.55 19.25,34.8 v19.25,35.2 | PQ60_RECEPTACLE.P$13 19.5,34.55
BATV_SW2  (via drill 0.4)
  Top 0.2: 21.9,34.65 21.75,34.8 v21.75,35.2 | PQ60_HEADER.P$18 22.5,34.05 21.9,34.65 | PQ60_HEADER.P$17 21.9,34.65
  Bottom 0.2: PQ60_RECEPTACLE.P$18 22.5,34.05 21.9,34.65 | v21.75,35.2 21.75,34.8 21.9,34.65 | 21.9,34.65 PQ60_RECEPTACLE.P$17
CARD_DETECT  (via drill 0.4, 0.4 pad 0.25)
  Top 0.2: U$4.1 13.68,19 13.5,19 13,19.5 v13,19.6 | 38.6,8.2 v38.9,8.2 38.41,8.2 v37.48,9.13 | v13.8,12.9 14.7,12 14.7,10.5 17.1,8.1 17.9,8.1 18.8,7.2 23.24,7.2 25.98,9.94 29.24,9.94 v29.54,10.24 | v38.21,10.54 37.5,11.25 37.5,15 38.7,16.2 38.7,17.3 38,18 35.78,18 35.18,17.4 v34.4,17.4
  Bottom 0.2: v13,19.6 12.6,19.2 9.2,19.2 8.8,19.6 7.8,19.6 7.6,19.4 7.6,14.6 8.5,13.7 12,13.7 12.8,12.9 v13.8,12.9 | v37.48,9.13 37.48,9.98 38.04,10.54 v38.21,10.54 | v38.9,8.2 38.7,8 35.6,8 33.36,10.24 v29.54,10.24 | v34.4,17.4 34.4,18.81 34.01,19.2 R10.1
GND  (via drill 0.4, 0.4 pad 0.25)
  Top 0.2: PQ60_HEADER.P$3 13.5,34.3 | 13.5,34.3 v13,34.8 | PQ60_HEADER.P$4 14.1,33.7 13.5,34.3 | PQ60_HEADER.P$7 15.9,34.4 v15.5,34.8 16.5,33.8 PQ60_HEADER.P$8 | PQ60_HEADER.P$12 18.9,33.9 v18,34.8 18.3,34.5 PQ60_HEADER.P$11 | PQ60_HEADER.P$55 15.3,39.4 v15.5,39.4 | PQ60_HEADER.P$56 14.7,39.4 v15.5,39.4 | 15.9,39.3 15.9,39.4 v15.5,39.4 | 16.5,37 PQ60_HEADER.P$53 16.5,39.4 16,39.4 arc90 15.9,39.3 | 15.9,39.3 PQ60_HEADER.P$54 | PQ60_HEADER.P$15 20.7,34.6 v20.5,34.8 21.3,34 PQ60_HEADER.P$16 | PQ60_HEADER.P$20 23.7,34.1 v23,34.8 23.1,34.7 PQ60_HEADER.P$19 | PQ60_HEADER.P$47 20.1,39.4 v20,39.4 | PQ60_HEADER.P$48 19.5,39.4 v20,39.4 | 20.5,39.4 v20,39.4 | PQ60_HEADER.P$45 21.3,38.7 20.7,39.3 | v20,39.4 20.6,39.4 20.7,39.3 | PQ60_HEADER.P$46 20.7,39.3 | v39.7,32.3 41.25,33.85 | v37.3,33.7 35.8,33.7 35,32.9 34.1,32.9 33.7,33.3 33.7,33.8 32.4,35.1 31,35.1 30.6,34.7 29.1,34.7 28.5,34.1 PQ60_HEADER.P$28 28.5,31.4 28.6,31.3 30.2,31.3 30.6,31.7 v30.7,31.7 | PQ60_HEADER.P$23 25.5,34.54 v25.28,34.76 26.1,33.94 PQ60_HEADER.P$24 | U$1.2 35.05,13.25 35.25,13.45 C9.2 35.8,13.55 35.8,15.8 v35.94,15.94 35.97,15.97 | C1.1 29.36,2.81 28.8,3.37 LSM9DS1.18 | C1.1 C3.2 28.65,1.5 v28.5,1.65 | 34.5,2.15 34.5,2.3 34.3,2.5 33.75,2.5 C2.2 | 34.5,2.15 34.5,1.4 | R11.2 24.55,5.45 24.85,5.15 U$3.2 25.3,3.65 C6.2 25.55,2.55 25.25,2.25 C5.2 24.2,1.2 23.7,1.7 v23.6,1.7 22.68,1.7 ERASE.B@2 21.2,0.49 18.93,0.49 ERASE.B@1 | D1.C 6.45,0.85 6.1,1.2 6.1,3.4 | 6.1,3.4 6.1,3.8 5.7,4.2 5.7,6 5.4,6.3 3.9,6.3 | D5.C 6.15,3.35 6.1,3.4 | U$4.47 22.2,26.8 22.2,26.4 21.2,25.4 20,25.4 19.8,25.2 19.8,22.3 20.2,21.9 v20.2,20.6 | C13.2 11.5,16.2 10.2,14.9 v8.7,14.9
  Top 0.2: U$4.31 26.7,19.9 26.7,20.1 27.2,20.6 28.4,20.6 28.9,21.1 28.9,21.7 29.81,22.61 NDK_NX3225SA.GND@2 | v28.3,20.2 28.7,20.6 28.7,22.2 | 10.6,19.9 9.8,19.9 v9.6,20.1 8.8,20.1 8.4,19.7 v8.4,18.8 | L3.1 9,9.4 8.3,10.1 | 32.6,31.3 33,31.7 35.5,31.7 37.3,29.9 37.3,28.7 35,26.4 v34.2,26.4 | U$9.3 40.61,13.71 41.18,14.28 41.18,18.02 40.2,19 | R15.2 33.4,7.75 | 34.5,2.15 35.16,2.15 35.16,2.44 v35.1,2.5 | D2.C 17.75,0.7 | NDK_NX3225SA.GND@1 33.33,21.01 v34.07,21.75 | v20.33,7.93 20.33,8.33 21.11,9.11 21.11,9.81 21.79,10.49 23.02,10.49 23.03,10.48 23.3,10.75 L4.1 | 28.29,7.6 28.3,7.59 28.3,5.73 28.48,5.54 LSM9DS1.14 29.26,5.55 29.41,5.4 29.41,5.27 29.25,5.12 LSM9DS1.15 29.17,5.11 29.39,4.89 29.39,4.88 29.2,4.68 LSM9DS1.16 29.22,4.69 29.38,4.53 29.38,4.39 | 35.65,6.5 v35.28,7.15 R17.2 | 29.38,4.39 29.31,4.32 | 29.31,4.32 29.25,4.25 LSM9DS1.17 | 29.31,4.32 29.31,3.92 29.27,3.88 29.27,3.72 LSM9DS1.19 29.23,2.62 C1.1 | LSM9DS1.20 29.66,4.12 29.38,4.39
  Top 0.25: U$4.4 16.5,19.7 v17,19.7
  Top 0.4: U$11.PIN$5 13.3,5.9 14.1,6.7 | 17.75,0.7 18.46,0.7 ERASE.B@1
  Bottom 0.2: v13,34.8 13.5,34.3 | 14.1,33.7 v13,34.8 | 16.5,33.8 v15.5,34.8 | 15.9,34.4 v15.5,34.8 | 18.9,33.9 v18,34.8 | 18.3,34.5 v18,34.8 | v15.5,39.4 14.7,39.4 PQ60_RECEPTACLE.P$56 | PQ60_RECEPTACLE.P$3 13.5,33.5 arc42 v13,34.8 | PQ60_RECEPTACLE.P$8 16.5,33.5 arc75 v15.5,34.8 | PQ60_RECEPTACLE.P$11 18.3,34 arc41 v18,34.8 | 23.1,34.7 v23,34.8 23.7,34.1 PQ60_RECEPTACLE.P$20 | v20,39.4 20.6,39.4 20.75,39.25 | 20.7,32.25 PQ60_RECEPTACLE.P$15 20.7,34.6 v20.5,34.8 | 21.3,32.25 21.25,32.25 21.25,34.05 v20.5,34.8 | PQ60_RECEPTACLE.P$45 21.3,38.7 20.75,39.25 | 20.75,39.25 20.7,39.2 PQ60_RECEPTACLE.P$46 20.7,35 v20.5,34.8 | PQ60_RECEPTACLE.P$47 20.1,39.4 v20,39.4 | PQ60_RECEPTACLE.P$48 19.5,39.4 v20,39.4 | v15.5,34.8 15.3,35 PQ60_RECEPTACLE.P$55 15.3,39.4 v15.5,39.4 | v15.5,39.4 16.5,39.4 PQ60_RECEPTACLE.P$53 | PQ60_RECEPTACLE.P$54 15.9,39.4 v15.5,39.4 | v39.7,32.3 38.3,33.7 v37.3,33.7 | 25.5,34.54 PQ60_RECEPTACLE.P$23 | v25.28,34.76 26.1,33.94 PQ60_RECEPTACLE.P$24 | v40.8,30.7 40.5,30.8 40,30.3 | 19.3,19.7 v17,19.7 14.2,19.7 13.3,18.8 9.3,18.8 8.9,18.4 8.6,18.4 8.4,18.6 v8.4,18.8 | v20.2,20.6 19.3,19.7 | C8.2 20.15,16.05 20.5,15.7 | 20.5,15.7 20.5,15.3 20.93,14.87 | 19.3,19.7 20.8,18.2 v20.8,16.9 20.83,16.87 | 28.7,22.4 28.7,20.6 v28.3,20.2 29.11,19.39 29.11,17.66 29.79,16.98 32.46,16.98 J2.S1 33.46,16.2 35.77,16.2 v35.94,15.94 | PQ60_RECEPTACLE.P$28 28.5,30.9 30.3,30.9 30.5,31.1 30.5,31.5 v30.7,31.7 | v28.5,1.65 23.65,1.65 v23.6,1.7 21.91,1.7 21.45,2.16 21.45,3.61 21.45,4.18 21.47,4.2 | 20.5,15.7 21.07,15.7 21.3,15.93 21.3,16.5 | U$9.3 U$9.5 41.18,11.7 41.18,9.18 39.4,7.4 38.6,7.4 38.4,7.6 35.91,7.6 35.51,7.2 35.65,6.5
  Bottom 0.2: 35.06,2.5 v35.1,2.5 | 34.12,3.44 34.12,4.47 J2.S3 35.2,4.97 35.2,7.07 v35.28,7.15 | C7.2 20.27,10.65 21.11,9.81 21.11,9.11 20.33,8.33 v20.33,7.93
  Bottom 0.3: 34.12,3.44 35.06,2.5
  other vias: 4.2,6.4 14,8.8 1.4,21.7 24.5,22.9 21.7,25.1 27.8,26.5 2.7,33.6 1.9,32.8 7.6,12.3
  pour Top (isolate 0.3): 0,6 16.8,6 16.8,0 36,0 36,3 arc-90 39,6 42,6 42,36 39,36.05 arc-90 36.05,39.1 36.1,42 6,42 6,39 arc-90 3,36 0,36
  pour Bottom (isolate 0.3): 0,6 16.8,6 16.8,0 36,0 36,3 arc-90 39.3,6.05 42,6 42,36 39,36.05 arc-90 36.05,39.1 36.1,42 6,42 6,39 arc-90 3,36 0,36
GPIO0  (via drill 0.4)
  Top 0.2: U$4.57 15.34,26.3 14.7,26.3 14.2,26.8 14.2,27.5 15,28.3 15,29.4 16.1,30.5 25,30.5 25.4,30.9 26.5,30.9 26.7,31.1 PQ60_HEADER.P$25 26.7,34.2 26.24,34.66 v26.24,35.34
  Bottom 0.2: 26.75,32.2 PQ60_RECEPTACLE.P$25 26.7,34.2 26.24,34.66 v26.24,35.34
GPIO1  (via drill 0.4)
  Top 0.2: v15,27.1 15.4,27.5 15.4,29.2 16.3,30.1 25.2,30.1 25.6,30.5 26.7,30.5 27.3,31.1 PQ60_HEADER.P$26 27.3,34.68 v27.2,34.78 | U$4.18 21.6,15.8 21.6,19.86 22.81,21.07 v22.81,21.64
  Bottom 0.2: PQ60_RECEPTACLE.P$26 27.3,34.68 v27.2,34.78 | v15,27.1 15.4,27.1 16.9,25.6 20,25.6 22.1,23.5 22.1,22.35 v22.81,21.64
GPIO2  (via drill 0.4)
  Top 0.2: PQ60_HEADER.P$34 27.9,39 28,39.1 32.65,39.1 v33.25,38.5 33.25,34.87 v34.5,33.62 | U$4.56 15.8,26.56 15.8,29 16.5,29.7 25.4,29.7 25.8,30.1 27,30.1 27.8,30.9 33.1,30.9 v33.2,30.8
  Bottom 0.2: v33.25,38.5 32.65,39.1 28,39.1 27.9,39 PQ60_RECEPTACLE.P$34 | v34.5,33.62 34.5,32.6 33.2,31.3 v33.2,30.8
GPIO3  (via drill 0.4)
  Top 0.2: PQ60_HEADER.P$35 27.3,39.05 27.75,39.5 34.15,39.5 34.2,39.45 34.2,36.4 v34.3,36.3 34.3,35.1 v34.6,34.8 | U$4.55 16.2,26.88 16.2,28.8 16.7,29.3 25.6,29.3 26,29.7 27.3,29.7 28.1,30.5 31.7,30.5 32.2,30 33.6,30 34.4,30.8 v34.4,30.9
  Bottom 0.2: PQ60_RECEPTACLE.P$35 27.3,39.05 27.75,39.5 34.15,39.5 34.2,39.45 34.2,36.4 v34.3,36.3 | v34.6,34.8 35.3,34.1 35.3,31.8 v34.4,30.9
GPIO4  (via drill 0.4)
  Top 0.2: PQ60_HEADER.P$36 26.7,39.05 27.55,39.9 34.5,39.9 34.6,39.8 34.6,37.25 35.5,36.35 v35.5,35.6 | U$4.49 19,28.32 19,28.6 19.3,28.9 25.8,28.9 26.2,29.3 27.5,29.3 28.3,30.1 31.5,30.1 32,29.6 35,29.6 v35.4,30
  Bottom 0.2: PQ60_RECEPTACLE.P$36 26.7,39.05 27.55,39.9 34.5,39.9 34.6,39.8 34.6,37.25 35.5,36.35 v35.5,35.6 35.7,35.4 35.7,30.3 v35.4,30
GPIO5  (via drill 0.4)
  Top 0.2: PQ60_HEADER.P$37 26.1,39.05 27.35,40.3 34.95,40.3 35.05,40.2 35.05,37.4 36.75,35.7 v36.75,34.75 | U$4.46 24.62,28.5 26,28.5 26.4,28.9 27.7,28.9 28.5,29.7 31.3,29.7 31.8,29.2 36.1,29.2 v36.4,28.9
  Bottom 0.2: PQ60_RECEPTACLE.P$37 26.1,39.05 27.35,40.3 34.95,40.3 35.05,40.2 35.05,37.4 36.75,35.7 v36.75,34.75 36.2,34.2 36.2,29.1 v36.4,28.9
GPIO6  (via drill 0.4)
  Top 0.2: PQ60_HEADER.P$38 25.5,39.05 27.15,40.7 35.3,40.7 35.45,40.55 35.45,37.6 v38.1,34.95 38.1,31.2 39.3,30 39.3,29.3 38.5,28.5 38.5,28.1 38.3,27.9 38.3,27.2 39.9,25.6 v39.9,25.3 | U$4.29 27.4,17.8 28.9,17.8 29.85,18.75 30.77,18.75 30.97,18.95 35.45,18.95 v35.7,19.2
  Bottom 0.2: PQ60_RECEPTACLE.P$38 25.5,39.05 27.15,40.7 35.3,40.7 35.45,40.55 35.45,37.6 v38.1,34.95 | v39.9,25.3 39.4,25.3 38.8,24.7 38.8,22.6 35.7,19.5 v35.7,19.2
GPIO7  (via drill 0.4)
  Top 0.2: PQ60_HEADER.P$39 24.9,39.05 26.95,41.1 35.55,41.1 35.85,40.8 35.85,37.8 37.8,35.85 39.15,35.85 39.45,35.55 v39.45,35.25 39.45,34.6 38.9,34.05 38.9,31 39.7,30.2 39.7,29.1 38.9,28.3 38.9,27.9 38.7,27.7 38.7,27.4 40,26.1 40.3,26.1 41.1,25.3 v41.1,24.8 | U$4.28 27.08,17.4 29.1,17.4 30.01,18.31 31.04,18.31 31.13,18.4 35.6,18.4 35.76,18.4 36.9,18.4 37.3,18.8 v37.3,19.4
  Bottom 0.2: PQ60_RECEPTACLE.P$39 24.9,39.05 26.95,41.1 35.55,41.1 35.85,40.8 35.85,37.8 37.8,35.85 39.15,35.85 39.45,35.55 v39.45,35.25 | v41.1,24.8 40.8,24.5 39.6,24.5 39.2,24.1 39.2,22.4 37.3,20.5 v37.3,19.4
GPIO8  (via drill 0.4)
  Top 0.2: PQ60_HEADER.P$40 24.3,39.05 26.75,41.5 35.75,41.5 36.25,41 36.25,38 38,36.25 39.75,36.25 40.25,35.75 40.25,34.1 v39.75,33.6 | U$4.62 15.62,22.5 16,22.5 20.3,26.8 v21.09,26.8 | v27.3,27.7 27.3,27.9 28.7,29.3 31.1,29.3 31.6,28.8 34.9,28.8 v35.5,28.2
  Bottom 0.2: PQ60_RECEPTACLE.P$40 24.3,39.05 26.75,41.5 35.75,41.5 36.25,41 36.25,38 38,36.25 39.75,36.25 40.25,35.75 40.25,34.1 v39.75,33.6 39.75,33.55 40.5,32.8 40.5,31.9 39.9,31.3 38,31.3 37.2,30.5 37.2,28.4 36.8,28 35.7,28 v35.5,28.2 | v27.3,27.7 22,27.7 v21.1,26.8 v21.09,26.8
GPIO9  (via drill 0.4)
  Top 0.2: 23.7,37.6 PQ60_HEADER.P$41 23.7,39.05 21.25,41.5 10.6,41.5 v4.3,35.2 4.3,33.3 5.7,31.9 5.7,27.5 6.8,26.4 7.8,26.4 8.2,26.8 10.3,26.8 12.9,24.2 12.9,23.8 13.2,23.5 13.2,22.7 14.6,21.3 17.8,21.3 18.6,20.5 18.6,18.1 18.9,17.8 18.9,16.42 U$4.12
  Bottom 0.2: PQ60_RECEPTACLE.P$41 23.7,39.05 21.25,41.5 10.6,41.5 v4.3,35.2
GPIO10  (via drill 0.4)
  Top 0.2: PQ60_HEADER.P$42 23.1,38.95 20.95,41.1 11.35,41.1 5.1,34.85 v5.1,34.4 | U$4.11 18.5,16.74 18.5,17.6 18.2,17.9 18.2,20.4 17.7,20.9 14.4,20.9 12.8,22.5 12.8,23.3 12.5,23.6 12.5,24 10.1,26.4 8.3,26.4 7.9,26 6.7,26 5.3,27.4 5.3,31.7 3.5,33.5 v3.5,34.4
  Bottom 0.2: PQ60_RECEPTACLE.P$42 23.1,38.95 20.95,41.1 11.35,41.1 5.1,34.85 v5.1,34.4 v3.5,34.4
GPIO11  (via drill 0.4)
  Top 0.2: PQ60_HEADER.P$43 22.5,38.9 20.7,40.7 11.7,40.7 5.9,34.9 v5.9,33.6 5.9,32.4 6.1,32.2 6.1,27.6 6.9,26.8 7.7,26.8 8.1,27.2 10.5,27.2 13.3,24.4 13.3,24 13.6,23.7 13.6,23.08 U$4.64 14.88,21.8 14.9,21.8 15,21.7 17.9,21.7 19,20.6 19,19.8 19.3,19.5 v20.7,19.5
  Bottom 0.2: PQ60_RECEPTACLE.P$43 22.5,38.9 20.7,40.7 11.7,40.7 5.9,34.9 v5.9,33.6 | v20.7,19.5 23.35,16.85 23.35,10.81 25.53,8.63 25.53,8.62 25.85,8.3 27.04,8.3 27.28,8.06 J2.2
GPIO12  (via drill 0.4)
  Top 0.2: PQ60_HEADER.P$44 21.9,38.85 20.45,40.3 12.05,40.3 6.7,34.95 v6.7,32.8 6.5,32.6 6.5,27.7 7,27.2 7.6,27.2 8,27.6 10.7,27.6 13.7,24.6 13.7,24.2 14,23.9 14,23.4 U$4.63
  Bottom 0.2: PQ60_RECEPTACLE.P$44 21.9,38.85 20.45,40.3 12.05,40.3 6.7,34.95 v6.7,32.8
ID  (via drill 0.4)
  Top 0.2: U$4.23 25.7,15.22 PTA1.TP 28.1,12.8 28.8,12.8 29.3,13.3 29.3,14.6 v28.9,15 | 33.45,15.35 U$1.6 33.45,16.84 32.46,17.83 30.19,17.83 28.96,16.6 v28.9,16.6 | U$11.P$4 12.65,3.85 12.9,3.6 16.74,3.6 16.82,3.68 16.82,5.91 17.19,6.28 18.63,6.28 18.95,5.96 v19,5.96 | v22.02,9.7 22.21,9.89 23.27,9.89 24.15,10.77 24.15,12.15 24.51,12.51 24.76,12.51 25.02,12.77 26,12.77 26,12.75 27.02,11.73 v27.02,11.2
  Bottom 0.2: v28.9,16.6 v28.9,15 28.8,15 27.7,13.9 27.7,12.07 27.02,11.39 v27.02,11.2 | v19,5.96 19.56,5.96 20.4,6.8 21.13,6.8 21.15,6.82 21.15,8.43 21.57,8.85 21.82,8.85 22.02,9.05 v22.02,9.7
LED_AMBER  (via drill 0.4)
  Top 0.2: U$4.41 22.64,23 v20.8,23 | v7.3,10.2 7.5,10 R13.2
  Bottom 0.2: v20.8,23 20.8,23.8 19.8,24.8 13.8,24.8 13,25.6 13,26.6 13.2,26.8 13.2,27.8 12.9,28.1 10.5,28.1 9.8,28.8 7,28.8 6,27.8 6,10.8 6.6,10.2 v7.3,10.2
LED_BLUE  (via drill 0.4)
  Top 0.2: U$4.26 26.29,16.79 27.08,16.79 v27.67,16.2 | R6.2 17.92,5.13 20.47,5.13 v20.68,5.34 | v21.92,8.04 21.92,8.33 22.78,9.19 23.25,9.19 25.36,11.3 v25.81,11.74
  Bottom 0.2: v27.67,16.2 27.67,14.51 26.68,13.52 26.68,12.61 v25.81,11.74 | v21.92,8.04 21.92,6.58 v20.68,5.34
MISO  (via drill 0.4)
  Top 0.2: PQ60_HEADER.P$32 29.1,36 29.4,35.7 30,35.7 30.25,35.95 30.25,37.15 30.5,37.4 v30.8,37.4 | 18.95,26.25 U$4.52 18,27.2 v17,27.2 | v33.8,27.7 33.1,28.4 29.11,28.4 v28.41,27.7
  Bottom 0.2: PQ60_RECEPTACLE.P$32 29.1,36 29.4,35.7 30,35.7 30.25,35.95 30.25,37.15 30.5,37.4 v30.8,37.4 31.1,37.4 32.5,36 32.5,35.5 33.4,34.6 33.4,32.6 31.4,30.6 31.4,28.7 31.9,28.2 31.9,27.3 | U1.2 3.8,9.7 5.6,11.5 5.6,27.9 6.9,29.2 9.9,29.2 10.6,28.5 12.8,28.5 13.7,29.4 15.9,29.4 16.2,29.1 16.2,28 v17,27.2 20.4,27.2 20.8,27.6 21.3,27.6 21.8,28.1 26.6,28.1 27,28.5 27.9,28.5 28.41,27.99 v28.41,27.7 | 31.9,27.3 31.5,26.9 31.1,26.9 25.99,21.79 25.99,19.32 24.89,18.22 24.89,11.34 26.34,9.89 27.84,9.89 29.12,8.61 32.39,8.61 32.77,8.23 J2.7 | 31.9,27.3 32.3,26.9 33.3,26.9 33.8,27.4 v33.8,27.7
MOSI  (via drill 0.4)
  Top 0.2: PQ60_HEADER.P$31 PQ60_RECEPTACLE.P$31 30.45,38.6 31.55,38.6 v31.95,38.2 | U$4.51 18.28,27.6 18,27.6 17.2,28.4 v17,28.4 | v29.53,27.69 v32.69,27.69
  Bottom 0.2: PQ60_RECEPTACLE.P$31 30.45,38.6 31.55,38.6 v31.95,38.2 31.95,37.3 33,36.25 33,35.75 33.76,34.99 33.76,32.46 31.8,30.5 31.8,28.9 32.69,28.01 v32.69,27.69 | U1.3 3.8,11.7 5.2,13.1 5.2,28.1 6.7,29.6 10,29.6 10.7,28.9 12.7,28.9 13.6,29.8 16.4,29.8 17,29.2 v17,28.4 17.2,28.4 18,27.6 20.2,27.6 20.6,28 21.1,28 21.6,28.5 26.4,28.5 26.8,28.9 28.32,28.9 v29.53,27.69 v29.54,27.68 29.54,26.46 24.89,21.81 24.89,19.82 23.81,18.74 23.81,11.02 25.95,8.88 25.95,8.87 26.05,8.77 27.34,8.77 28.39,7.72 J2.3
N$1
  Top 0.2: U$4.32 28.42,18.9 TP2.TP 29.31,19.71 30.04,19.71 30.21,19.88 NDK_NX3225SA.1
N$2  (via drill 0.4)
  Top 0.2: U$1.1 34.95,12.75 35.55,12.15 C9.1 v35.7,10.7 | SJ3.P$1 39.4,16.3 39.25,16.15 39.15,16.15 37.9,14.9 37.9,12.1 v38.21,11.79
  Bottom 0.2: v35.7,10.7 36,10.7 37.09,11.79 v38.21,11.79
N$3  (via drill 0.4)
  Top 0.2: U$1.10 31.55,13.75 31.05,13.25 R9.1 | 30.55,13.25 R9.1 | v29.68,11.96 29.68,12.31 30.48,13.11 R9.1 | ERASE.A@1 19.29,3.32 21.18,3.32 ERASE.A@2 22.92,2.79 v23.15,3.02 | v23.16,8.36 25.27,10.47 27.77,10.47 v28.3,11
  Bottom 0.2: v23.16,8.36 23.16,2.96 23.15,2.97 v23.15,3.02 | v29.68,11.96 29.26,11.96 v28.3,11
N$4
  Top 0.2: U$4.19 23.8,14.32 23.8,13.8 TP4.TP
N$5
  Top 0.4: 12,6.3 12,6.75 arc-90 R3.1 | 12.9,7 arc-90 12.2,6.3 12,6.3 | U$11.P$3 12,6.3 | 12,6.3 12.5,6.8
N$6
  Top 0.4: R1.1 arc-90 11.35,6.7 11.35,6.2 | U$11.P$2 11.35,6.2 | 11.35,6.2 11,6.55 11,6.9 | 11.35,6.2 arc-90 10.4,7.15 10.4,7.4 arc-90 10.8,7 10.8,6.7
N$7
  Top 0.2: U$4.20 24.4,14.4 TP3.TP
N$8
  Top 0.2: U$4.61 TP5.TP
N$9
  Bottom 0.2: R10.2 30.68,18.79 J2.SW
N$11
  Top 0.2: U$1.16 33.95,11.35 TP16.TP
N$12
  Bottom 0.2: TP10.TP 19.73,9.29 19.32,9.7 U1.15
N$13
  Bottom 0.8: U1.9 11.1,21.7 arc-90 9.5,23.3 U.FL.P$3
N$14
  Bottom 0.2: U1.16 18.8,7.7 TP11.TP
N$15  (via drill 0.4)
  Top 0.2: 27.4,6.4 U$3.3 27.4,5.7 v26.5,4.8
  Bottom 0.2: J2.6 31.68,5.29 30.74,4.35 30.59,4.2 30.34,3.95 27.13,3.95 26.5,4.58 v26.5,4.8
N$16
  Bottom 0.3: TP12.TP 18.9,17.7 U1.11
N$17
  Top 0.2: D2.A 17.6,3.55 arc-90 R6.1
N$18
  Bottom 0.2: TP13.TP U1.12
N$19
  Bottom 0.2: TP14.TP U1.7
N$20  (via drill 0.4)
  Top 0.2: U$1.13 32.45,11.35 RST.TP 32.4,11.2 32.9,10.7 34.1,10.7 v34.9,9.9 | U$1.4 35.05,14.25 35.2,14.4 35.2,16.3 v35.98,17.07 36.5,17.6 37.9,17.6 38.3,17.2 38.3,16.3 37.1,15.1 37.1,10.5 37.8,9.8 39.03,9.8 U$9.10 | U$4.34 27.35,22.74 29.14,24.53 34.03,24.53 34.66,23.9 34.66,22.98 v34.91,22.73
  Bottom 0.2: v34.9,9.9 36.4,8.4 37.9,8.4 39.13,9.63 U$9.10 | v34.91,22.73 34.91,18.14 v35.98,17.07
N$21
  Top 0.2: U$1.14 32.95,11.55 TP15.TP
N$22
  Top 0.2: R7.1 6.1,6.75 6.1,4.38 6.38,4.1 7.22,4.1 7.5,3.82 7.5,2.7 7.15,2.35 D1.A
N$23
  Top 0.2: U$4.33 28.42,23.1 TP1.TP 29.41,24.01 31.02,24.01 NDK_NX3225SA.3
N$24  (via drill 0.4)
  Top 0.2: U$4.13 17.2,14 R12.2 16.65,12.45 16.4,12.2 16.4,10.7 16.6,10.5 20.15,10.5 C15.1
  Top 0.3: v10.1,16.1 10.4,16.4 L2.2 | U$4.13 19.9,16.7 v19.9,18.1
  Bottom 0.3: v19.9,18.1 19.3,18.7 13.9,18.7 13.5,18.3 11.1,18.3 10.1,17.3 v10.1,16.1
N$25
  Top 0.2: U$4.14 18.1,14.22 18.1,12.1 18.1,12.05 | C17.1 18.1,12.05 | R12.1 18.1,12.05
N$26
  Top 0.2: U$4.16 18.9,13.58 | U$4.15 18.7,14.1 18.7,13.78 18.9,13.58 | 18.9,13.58 19,13.48 C17.2 20.4,12.45 C15.2 20.65,12.65 21.5,11.8 22,11.8 22.2,11.6 | C16.2 22.2,11.6 | 22.2,11.6 22.4,11.8 23.1,11.8 23.3,12 L4.2
N$27
  Top 0.2: U$4.17 23,13.68 23,13.3 22.8,13.1 22.5,13.1 22.2,12.8 C16.1
N$28
  Top 0.2: U$4.59 15.5,24.74 15.5,25.2 TP6.TP
N$29
  Top 0.2: U$4.60 15.1,24.42 15.1,24.7 14.5,25.3 TP7.TP
N$30
  Top 0.2: U$4.44 24.62,27.1 TP8.TP
N$31
  Top 0.2: U$4.45 24.6,27.8 TP9.TP
N$32
  Top 0.2: LSM9DS1.24 31.38,2.88 31.1,2.6 C1.2
N$33
  Top 0.2: C3.1 30.1,1.5 29.9,1.7 29.9,3.2 30.09,3.38 LSM9DS1.21
N$34
  Top 0.2: LSM9DS1.7 31.38,7.5 R16.1
N$35
  Top 0.2: LSM9DS1.8 30.95,6.55 30.42,7.08 R14.1
N$37
  Top 0.2: R13.1 7.5,6.7 6.8,6 D5.A
N$38
  Top 0.2: LSM9DS1.6 31.81,6.23 31.81,6.53 31.9,6.62 32.65,6.62 R15.1
N$39
  Top 0.2: 33.85,5.7 R17.1 34.01,5.66 32.15,5.66 32.03,5.54 LSM9DS1.5
NIRQ  (via drill 0.4)
  Top 0.2: v22.4,16.4 22.4,19.83 24.8,22.23 26.08,22.23 26.95,23.1 U$4.35
  Bottom 0.2: U1.14 18.7,11.7 18.8,11.6 21.9,11.6 22.4,12.1 v22.4,16.4
NSEL  (via drill 0.4)
  Top 0.2: v12.4,30.2 12.4,29.9 v13.9,28.4 | v23.2,24.9 23.2,24.96 U$4.43
  Bottom 0.2: U1.5 3.8,15.7 4.4,16.3 4.4,28.5 6.3,30.4 10.2,30.4 10.9,29.7 11.9,29.7 v12.4,30.2 | v13.9,28.4 15.1,28.4 16,27.5 16,27.1 17.1,26 22.1,26 v23.2,24.9
RADIO_RST  (via drill 0.4)
  Top 0.2: v11.2,30.5 11.2,29.9 13.8,27.3 v13.8,26.1 | U$4.27 25.06,18.7 24.66,18.7 24.17,19.19 v24.17,20.2
  Bottom 0.2: U1.6 3.8,17.7 4,17.9 4,28.7 6.1,30.8 10.9,30.8 v11.2,30.5 | v13.8,26.1 15.7,26.1 16.6,25.2 19.9,25.2 21.7,23.4 21.7,21.3 22.07,20.93 23.44,20.93 v24.17,20.2
RESET  (via drill 0.4)
  Top 0.2: PQ60_HEADER.P$27 27.9,34.2 28.3,34.6 v28.3,35.01
  Bottom 0.2: PQ60_RECEPTACLE.P$27 27.9,34.2 28.3,34.6 v28.3,35.01
SCK  (via drill 0.4, 0.4 pad 0.91)
  Top 0.2: PQ60_HEADER.P$33 28.5,35.75 28.75,35.75 29.2,35.3 30.5,35.3 v31.25,36.05 | U$4.50 18.3,28.3 v18.2,28.5
  Bottom 0.2: PQ60_RECEPTACLE.P$33 28.5,35.75 28.75,35.75 29.2,35.3 30.5,35.3 v31.25,36.05 33,34.3 33,32.7 29.6,29.3 | U1.4 3.8,13.7 4.8,14.7 4.8,28.3 6.5,30 10.1,30 10.8,29.3 12.6,29.3 13.5,30.2 16.5,30.2 v18.2,28.5 | 17.5,29.2 v18.2,28.5 | v18.2,28.5 18.3,28.4 20.9,28.4 21.4,28.9 26.1,28.9 26.5,29.3 29.6,29.3 | 29.6,29.3 29.94,29.3 31.09,28.15 31.09,27.41 25.45,21.77 25.45,19.59 24.34,18.48 24.34,11.2 26.2,9.34 27.58,9.34 28.88,8.04 30.21,8.04 30.58,7.67 J2.5
SCL  (via drill 0.4, 0.4 pad 0.91)
  Top 0.2: PQ60_HEADER.P$29 29.1,34.1 29.3,34.3 v31.33,34.3 32.5,34.3 33.3,33.5 33.3,33.2 34,32.5 35.81,32.5 38.5,29.81 v38.5,29.7 38.1,29.3 38.1,28.3 37.8,28 37.8,27.1 39,25.9 39,25 39.5,24.5 40.4,24.5 41.4,23.5 41.4,21.2 41.25,21.05 R2.2 40.6,19.4 41.54,18.4 41.54,9 38.5,5.9 36.05,3.45 33.99,3.45 33.49,3.95 33.32,3.95 33.28,3.99 32.28,3.99 32.08,4.19 31.84,4.19 LSM9DS1.2 | U$4.37 27.58,25.1 35.4,25.1 v36.7,26.4
  Bottom 0.2: PQ60_RECEPTACLE.P$29 29.1,34.1 29.3,34.3 v31.33,34.3 | v36.7,26.4 38.5,28.2 v38.5,29.7
SD_POWER  (via drill 0.4)
  Top 0.2: U$3.1 24.95,7.05 24.65,6.75 R11.1 18.55,6.75 17.7,7.6 v14.8,7.6 | U$4.2 15.2,19.8 15.2,20.3 15,20.5 14.2,20.5 12.4,22.3 12.4,23 11.6,23.8 10.5,23.8 4.9,18.2 4.9,10.4 4.4,9.9 v4.4,8.2
  Bottom 0.2: v4.4,8.2 4.4,9.8 5.1,10.5 5.8,10.5 9,7.3 14.5,7.3 v14.8,7.6
SDA  (via drill 0.4)  (1 unrouted)
  Top 0.2: v39.4,20.2 R8.2 38.85,21.05 38.6,21.3 38.6,25.7 36.75,27.55 | U$4.38 27.26,25.5 34.7,25.5 36.75,27.55 | 36.75,27.55 37.7,28.5 37.7,30.05 35.65,32.1 31.5,32.1 30.71,32.89 v30.71,32.91 30.2,32.91 29.72,32.43 | LSM9DS1.4 32.15,5.12 32.29,5.26 33.57,5.26 33.72,5.11 34.69,5.11 35.26,5.68 35.27,5.68 35.47,5.88 36.98,5.88 v37.9,6.8
  Bottom 0.2: v39.4,20.2 39.8,20.2 41.54,18.4 41.54,9 39.4,6.8 v37.9,6.8 | v30.71,32.91 30.19,32.9 29.7,32.41 PQ60_RECEPTACLE.P$30
SHIELD  (via drill 0.4)
  Top 0.5: L3.2 9,6.1 8.2,5.3 8.2,4.9 8.3,4.8 U$11.GND@5
  other vias: 15.9,5.1 8,5.1
  pour Top: 7.6,-0.1 7.6,5.5 16.3,5.5 16.3,-0.1
  pour Bottom (isolate 0.3): 7.6,-0.1 7.6,5.5 16.3,5.5 16.3,-0.1
SWDCLK  (via drill 0.4)
  Top 0.2: U$4.22 25,15.24 25,15 PTA0.TP 27.6,12.4 29.04,12.4 29.79,13.15 29.79,14.74 v30.25,15.2 30.49,15.44 32.26,15.44 32.45,15.25 U$1.8
  Bottom 0.2: U$9.4 32.69,13.71 31.2,15.2 v30.25,15.2
SWDIO  (via drill 0.4)
  Top 0.2: U$4.25 25.96,16.4 26.22,16.4 PTA3.TP 26.8,15.82 | U$1.7 32.95,15.35 32.06,16.24 v31.47,16.24 v31.46,16.24 30.21,16.24 29.79,15.82 28.47,15.82 27.91,15.26 27.43,15.26 26.87,15.82 26.8,15.82 | 26.82,15.8 26.8,15.82
  Bottom 0.2: U$9.2 39.13,14.93 38.39,14.19 33.66,14.19 U$1.7 32.95,15.35 32.06,16.24 v31.47,16.24
SWO  (via drill 0.4)
  Top 0.2: U$4.24 25.74,15.9 25.9,15.9 PTA2.TP | PTA2.TP 26.9,14.9 | v28.5,13.6 28.2,13.6 PTA2.TP | v30.94,14.25 U$1.9
  Bottom 0.2: v28.5,13.6 30.3,13.6 30.3,13.61 v30.94,14.25 31.49,14.25 32.58,13.16 38.41,13.16 U$9.6
USB_D_N
  Top 0.2: 14.04,15.8 13.56,16.29
  Top 0.25: 15.62,17.39 14.6,15.7 14.9,16.6 14.3,16.2 14.5,15.9 14.6,16.3
  Top 0.295: 15.62,17.39 15.38,17.14
  Top 0.3: U$4.6 15.38,17.14 15,16.7 14.49,16.39 | 14.04,15.8 13.94,15.8 | 13.56,16.29 13.1,16.2 | 13.1,16.2 14,15.3 14.4,15.4 14.7,15.6 15,15.9 15.2,16.2 15.3,16.4 15.4,16.7 15.5,17.2 | 14.49,16.39 12.92,15.45 | 13.1,16.2 14.49,16.39
  Top 0.4: R1.2 10.85,9.2 10.93,9.2
  Top 1.295: 10.93,9.05 10.93,9.2 10.93,9.71 | 13.94,15.8 arc90 10.94,12.9 10.94,9.7 10.93,9.71 | 10.93,9.71 10.93,9.95
USB_D_P  (via drill 0.4 pad 1.29)
  Top 0.25: 13.9,17.5 v14,17.3 arc56 15.04,17.52 14.02,17.52 arc90 13.7,17.2 arc90 14,16.9 arc57 15.1,17.5 | 15.1,17.5 13.8,17.3 13.9,17 14.2,17.1 14.6,17.5 15,17.6 | 15.2,17.7 15.1,17.5 | 15.1,17.5 15.3,17.8 U$4.5
  Top 0.3: 15.2,17.7 14.7,17.5 14.4,17.6 14.3,17.7 14.8,17.5 14.5,17.6 15.1,17.6 14.7,17.1 14.4,16.9 14.1,16.8 13.9,16.8
  Top 0.4: 12.37,9.05 R3.2
  Top 1.295: 12.37,9.05 12.37,9.71 | v14,14.3 13.9,14.3 arc90 12.38,12.9 12.38,9.7 12.37,9.71 | 12.37,9.71 12.37,9.95
  Bottom 1.295: v14,17.3 v14,14.3
USB_VBUS  (via drill 0.4)
  Top 0.2: v24.25,35.2 24.25,34.7 24.3,34.65 | PQ60_HEADER.P$22 24.9,34.05 24.3,34.65 | PQ60_HEADER.P$21 24.3,34.65
  Top 0.3: U$11.P$1 10.7,5.5 9.8,6.4 9.8,10 v9,10.8 | PQ60_HEADER.P$22 24.9,31.3 24.6,31 24.1,31 | PQ60_HEADER.P$21 24.3,31.2 24.1,31 | 24.1,31 11.9,31 v11.2,31.7 | v2.9,26.5 5.4,26.5 6.8,25.1 v6.8,23
  Bottom 0.2: v24.25,35.2 24.25,34.7 24.3,34.65 | PQ60_RECEPTACLE.P$22 24.9,34.05 24.3,34.65 | PQ60_RECEPTACLE.P$21 24.3,34.65
  Bottom 0.3: v11.2,31.7 10.75,31.25 5.85,31.25 3.5,28.9 3.5,27.1 v2.9,26.5
  Bottom 0.4: v6.8,23 6.5,22.7 6.5,11.5 6.9,11.1 8.7,11.1 v9,10.8

### Text on the board
tPlace: PocketQube / OBC | Ver. 2.0 / Rev. D
tNames: MKL02Z
tDocu: Copyright 2019 Satellite Applications Catapult | Designed and manufactured in the UK | Y | Z | * | Warranty / void if / removed | X | buildubo.co.uk
bDocu: Coaxial connector | U.FL | ANT-> | SWD / debug | Micro SD socket | RFM69 433MHz radio